# EAGLE design Datalogger_v1 (EAGLE 6.5.0)
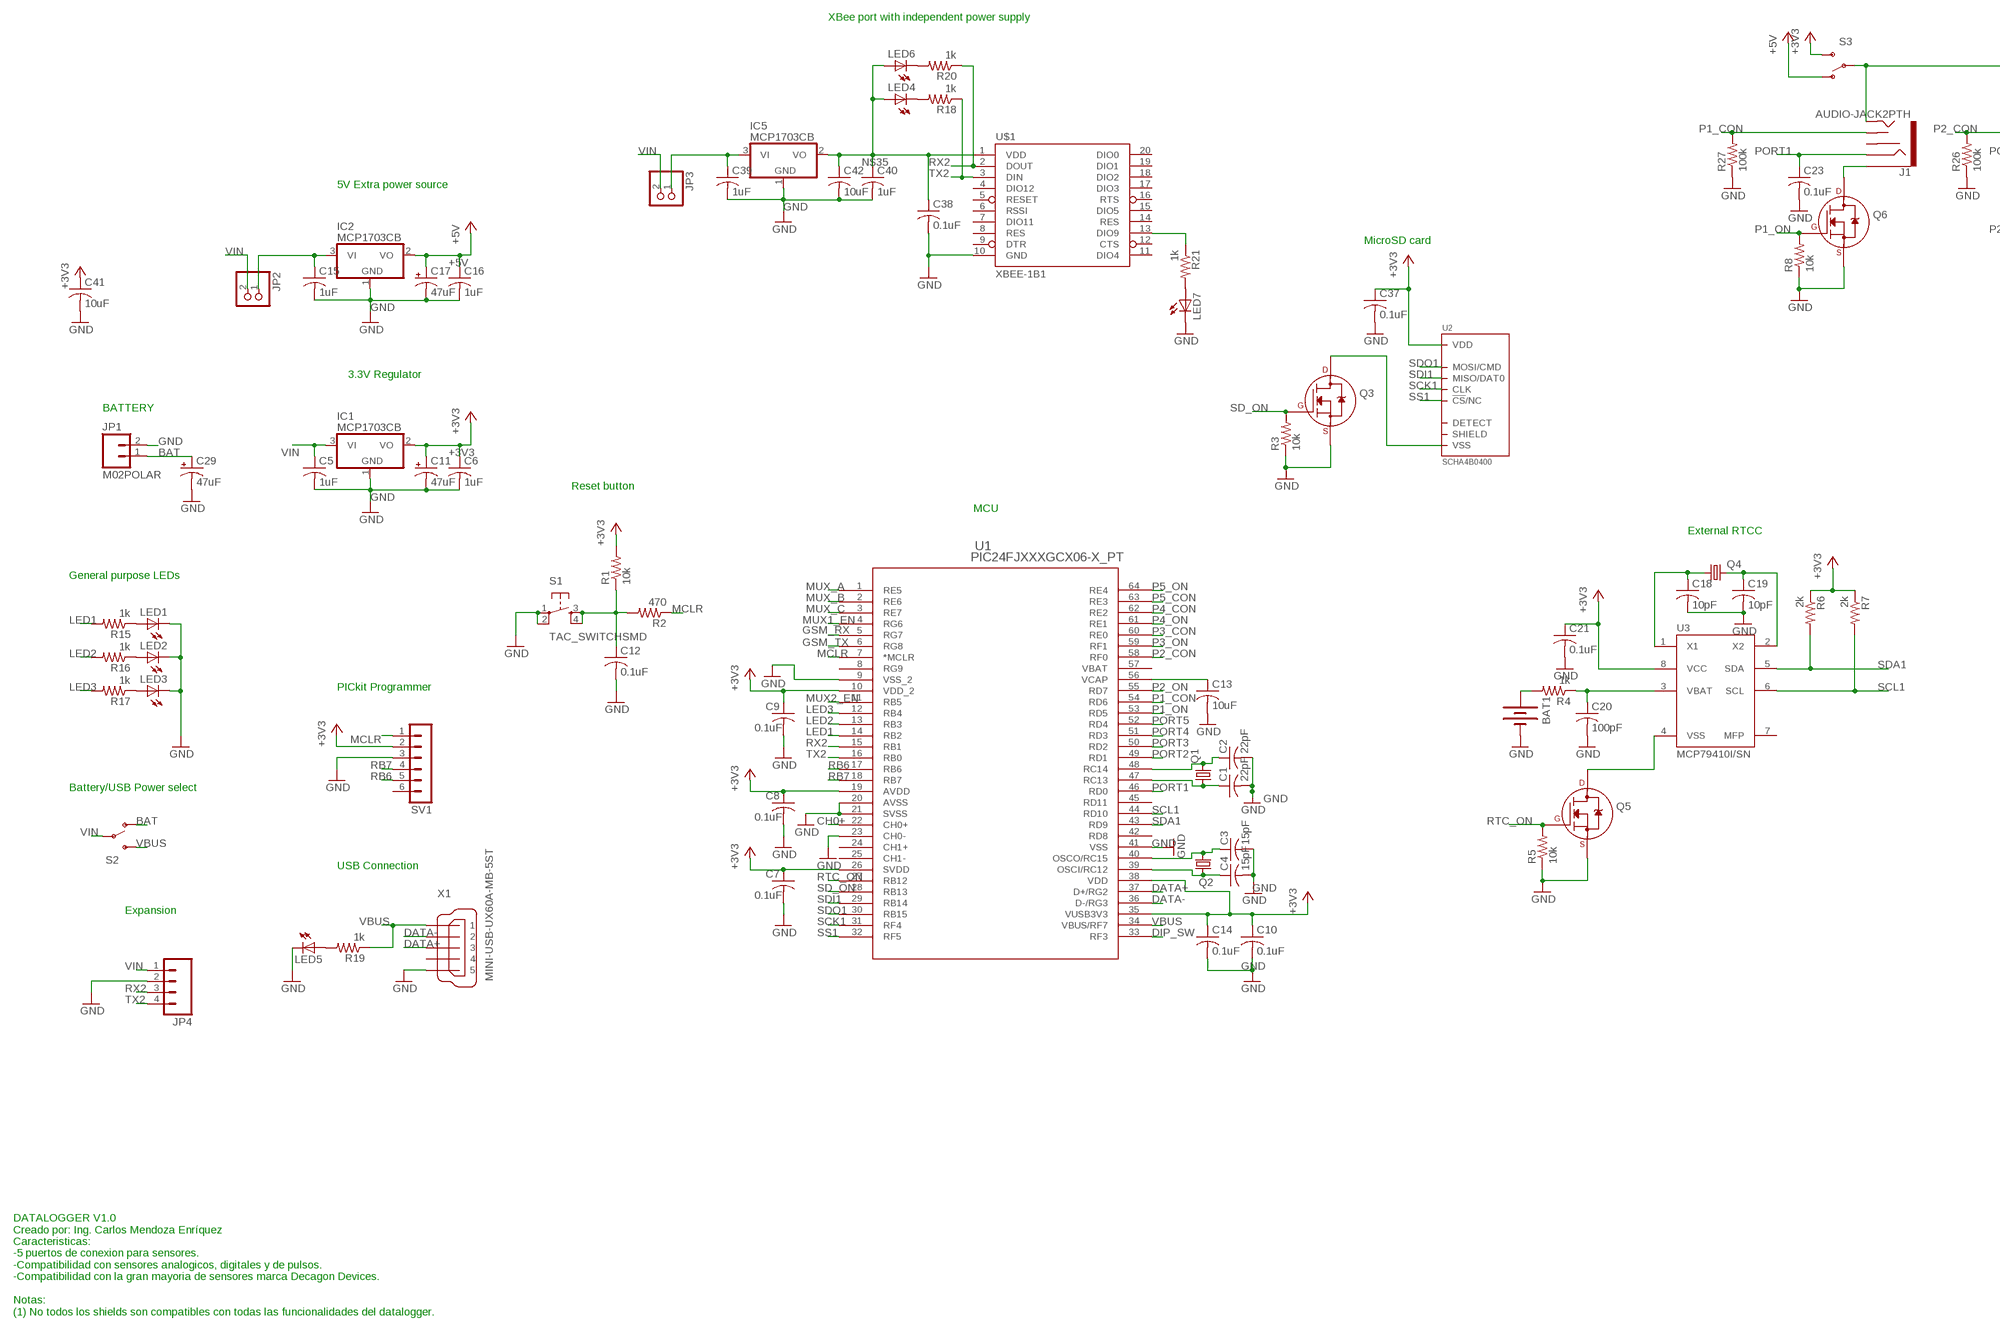
[diagram p0: schematic, sheet 1, part 1 of 2]
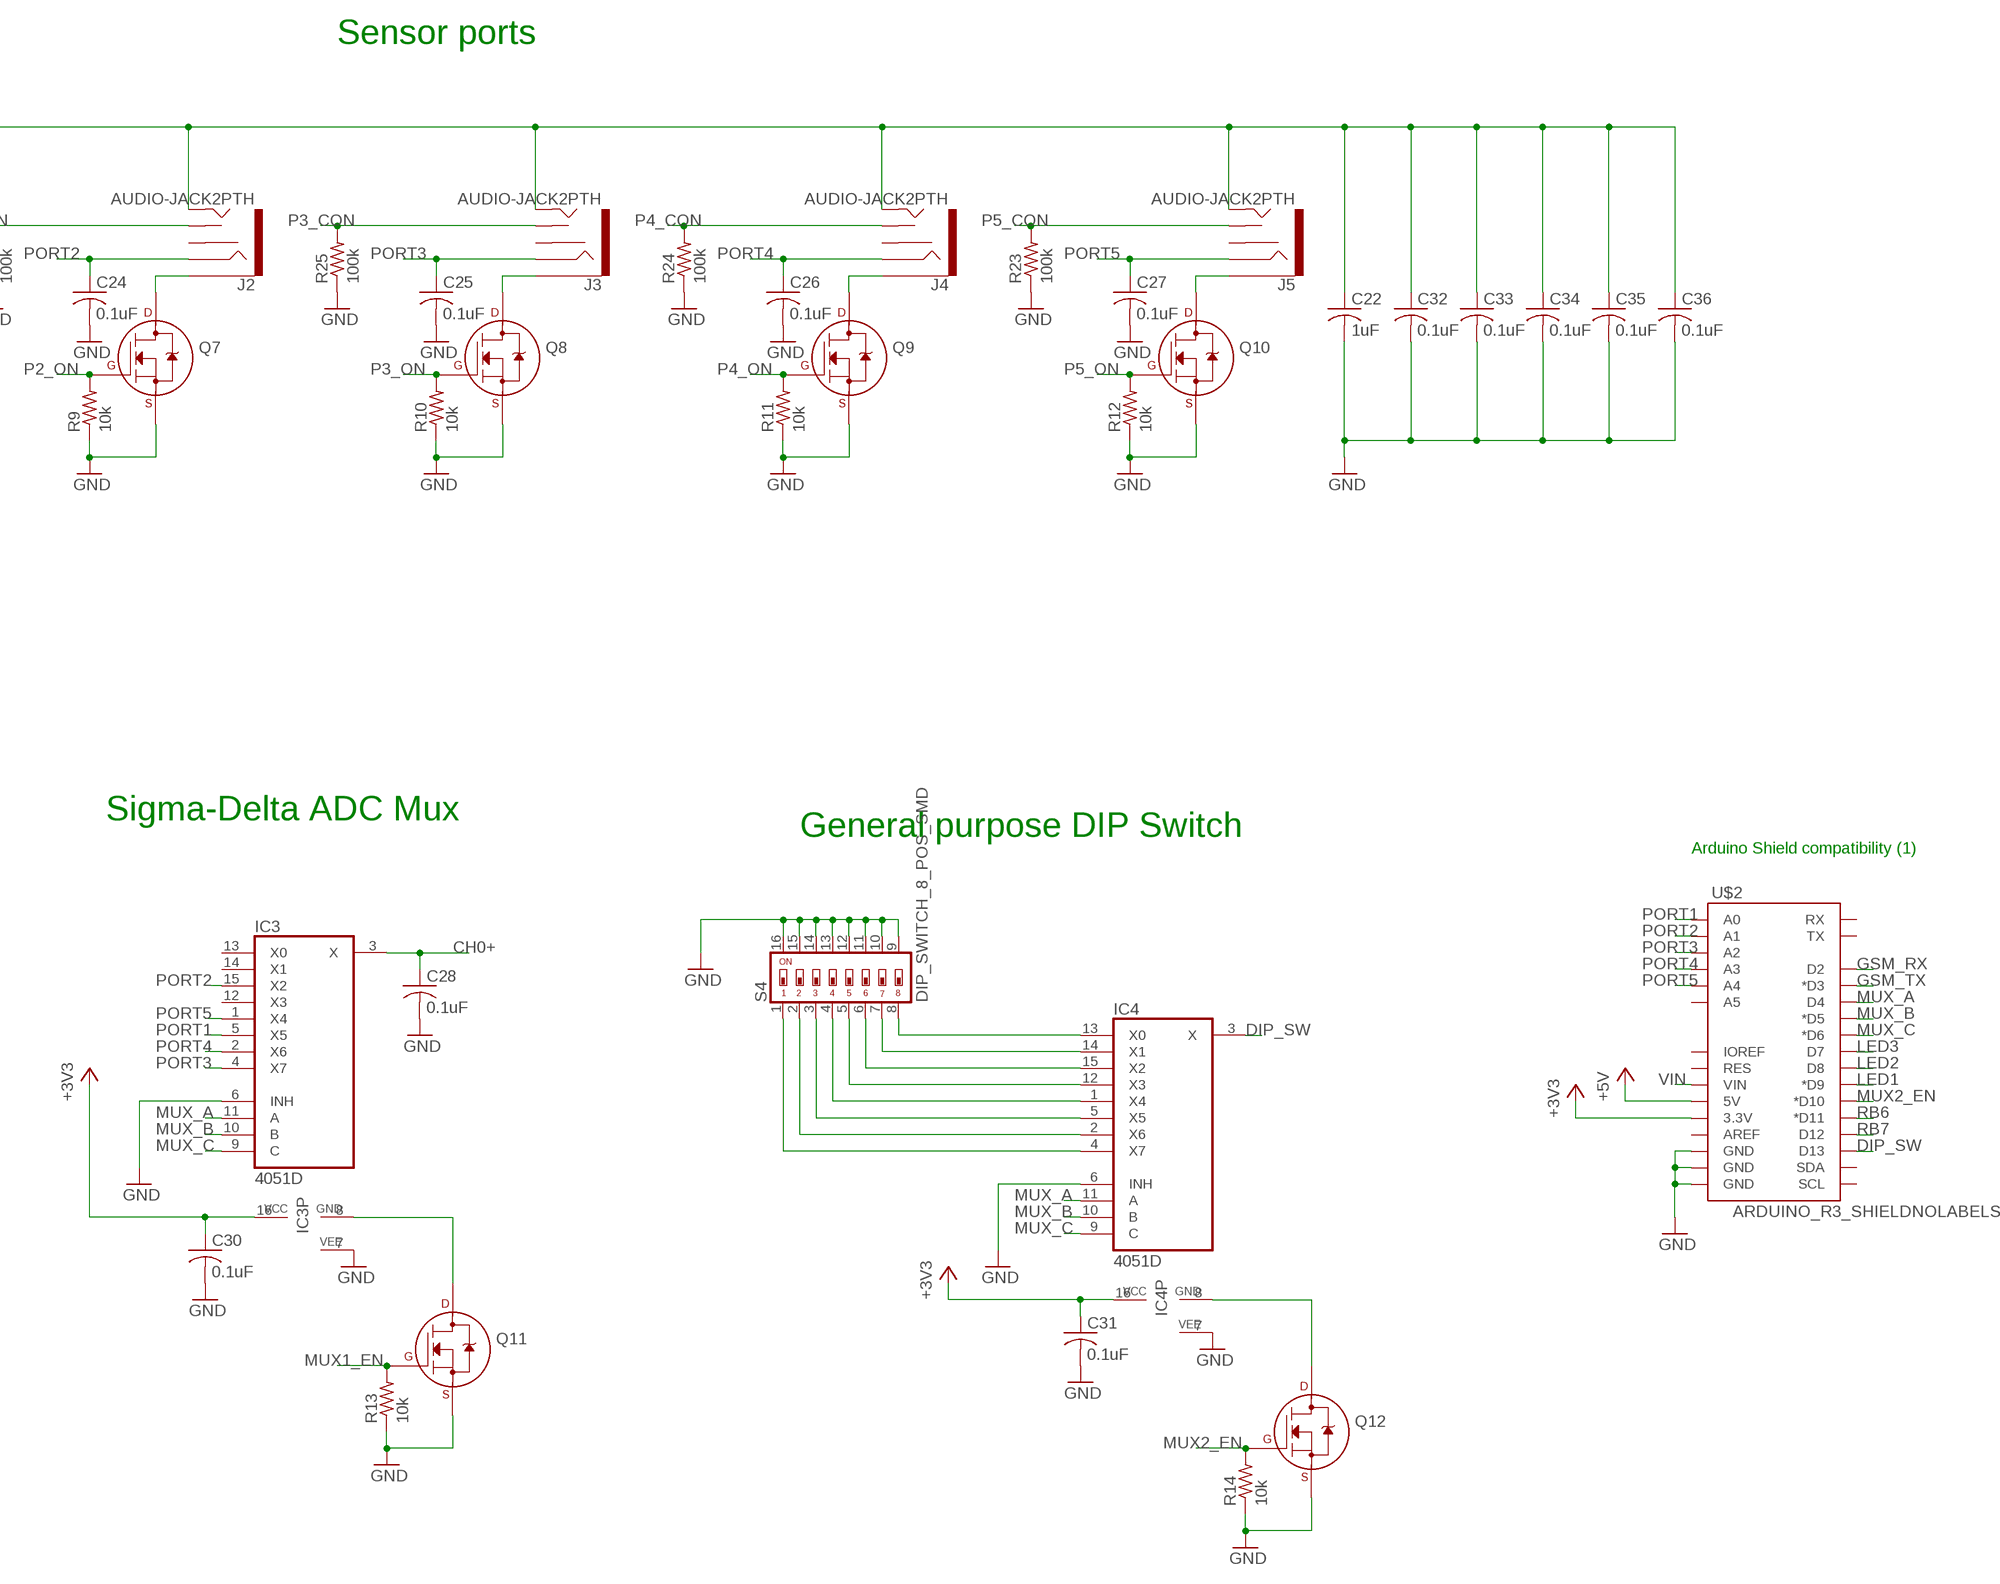
[diagram p1: schematic, sheet 1, part 2 of 2]

## Parts
BAT1  BATTERY20PTH  [BATTCOM_20MM_PTH]
C1  22pF  C-USC0603K  [C0603K]
C2  22pF  C-USC0603K  [C0603K]
C3  15pF  C-USC0603K  [C0603K]
C4  15pF  C-USC0603K  [C0603K]
C5  1uF  C-USC0805K  [C0805K]
C6  1uF  C-USC0805K  [C0805K]
C7  0.1uF  C-USC0805K  [C0805K]
C8  0.1uF  C-USC0805K  [C0805K]
C9  0.1uF  C-USC0805K  [C0805K]
C10  0.1uF  C-USC0805K  [C0805K]
C11  47uF  CPOL-US153CLV-0605  [153CLV-0605]
C12  0.1uF  C-USC0805K  [C0805K]
C13  10uF  C-USC0805K  [C0805K]
C14  0.1uF  C-USC0805K  [C0805K]
C15  1uF  C-USC0805K  [C0805K]
C16  1uF  C-USC0805K  [C0805K]
C17  47uF  CPOL-US153CLV-0605  [153CLV-0605]
C18  10pF  C-USC0603K  [C0603K]
C19  10pF  C-USC0603K  [C0603K]
C20  100pF  C-USC0805K  [C0805K]
C21  0.1uF  C-USC0805K  [C0805K]
C22  1uF  C-USC0805K  [C0805K]
C23  0.1uF  C-USC0805K  [C0805K]
C24  0.1uF  C-USC0805K  [C0805K]
C25  0.1uF  C-USC0805K  [C0805K]
C26  0.1uF  C-USC0805K  [C0805K]
C27  0.1uF  C-USC0805K  [C0805K]
C28  0.1uF  C-USC0805K  [C0805K]
C29  47uF  CPOL-US153CLV-0605  [153CLV-0605]
C30  0.1uF  C-USC0805K  [C0805K]
C31  0.1uF  C-USC0805K  [C0805K]
C32  0.1uF  C-USC0805K  [C0805K]
C33  0.1uF  C-USC0805K  [C0805K]
C34  0.1uF  C-USC0805K  [C0805K]
C35  0.1uF  C-USC0805K  [C0805K]
C36  0.1uF  C-USC0805K  [C0805K]
C37  0.1uF  C-USC0805K  [C0805K]
C38  0.1uF  C-USC0805K  [C0805K]
C39  1uF  C-USC0805K  [C0805K]
C40  1uF  C-USC0805K  [C0805K]
C41  10uF  C-USC0805K  [C0805K]
C42  10uF  C-USC0805K  [C0805K]
IC1  MCP1703CB  [SOT23]
IC2  MCP1703CB  [SOT23]
IC3  4051D  [SO16]
IC4  4051D  [SO16]
IC5  MCP1703CB  [SOT23]
J1  AUDIO-JACK2PTH  [AUDIO-JACK]
J2  AUDIO-JACK2PTH  [AUDIO-JACK]
J3  AUDIO-JACK2PTH  [AUDIO-JACK]
J4  AUDIO-JACK2PTH  [AUDIO-JACK]
J5  AUDIO-JACK2PTH  [AUDIO-JACK]
JP1  M02POLAR  [MOLEX-1X2]
JP2  PINHD-1X2  [1X02]
JP3  PINHD-1X2  [1X02]
JP4  M04POLAR  [MOLEX-1X4]
LED1  LEDCHIPLED_0603  [CHIPLED_0603]
LED2  LEDCHIPLED_0603  [CHIPLED_0603]
LED3  LEDCHIPLED_0603  [CHIPLED_0603]
LED4  LEDCHIPLED_0603  [CHIPLED_0603]
LED5  LEDCHIPLED_0603  [CHIPLED_0603]
LED6  LEDCHIPLED_0603  [CHIPLED_0603]
LED7  LEDCHIPLED_0603  [CHIPLED_0603]
Q1  CRYSTALMM20SS  [MM20SS]
Q2  CSM-7X-DU  [CSM-7X-DU]
Q3  2N7000_SOT23  [SOT-23]
Q4  CRYSTALMM20SS  [MM20SS]
Q5  2N7000_SOT23  [SOT-23]
Q6  2N7000_SOT23  [SOT-23]
Q7  2N7000_SOT23  [SOT-23]
Q8  2N7000_SOT23  [SOT-23]
Q9  2N7000_SOT23  [SOT-23]
Q10  2N7000_SOT23  [SOT-23]
Q11  2N7000_SOT23  [SOT-23]
Q12  2N7000_SOT23  [SOT-23]
R1  10k  R-US_R0805  [R0805]
R2  470  R-US_R0805  [R0805]
R3  10k  R-US_R0805  [R0805]
R4  1k  R-US_R0805  [R0805]
R5  10k  R-US_R0805  [R0805]
R6  2k  R-US_R0805  [R0805]
R7  2k  R-US_R0805  [R0805]
R8  10k  R-US_R0805  [R0805]
R9  10k  R-US_R0805  [R0805]
R10  10k  R-US_R0805  [R0805]
R11  10k  R-US_R0805  [R0805]
R12  10k  R-US_R0805  [R0805]
R13  10k  R-US_R0805  [R0805]
R14  10k  R-US_R0805  [R0805]
R15  1k  R-US_R0805  [R0805]
R16  1k  R-US_R0805  [R0805]
R17  1k  R-US_R0805  [R0805]
R18  1k  R-US_R0805  [R0805]
R19  1k  R-US_R0805  [R0805]
R20  1k  R-US_R0805  [R0805]
R21  1k  R-US_R0805  [R0805]
R23  100k  R-US_R0805  [R0805]
R24  100k  R-US_R0805  [R0805]
R25  100k  R-US_R0805  [R0805]
R26  100k  R-US_R0805  [R0805]
R27  100k  R-US_R0805  [R0805]
S1  TAC_SWITCHSMD  [TACTILE-SWITCH-SMD]
S2  SWITCH-SPDT-SMD-A  [SWITCH-SPST-SMD-A]
S3  SWITCH-SPDT-SMD-A  [SWITCH-SPST-SMD-A]
S4  DIP_SWITCH_8_POS_SMD  [SWITCH_04]
SV1  MA06-1  [MA06-1]
U1  PIC24FJXXXGCX06-X_PT  [TQFP64_10X10MC]
U2  SCHA4B0400  [SCHA4B0400]
U3  MCP79410I/SN  [SO8]
U$1  XBEE-1B1  [XBEE-1]
U$2  ARDUINO_R3_SHIELDNOLABELS  [UNO_R3_SHIELD_NOLABELS]
X1  MINI-USB-UX60A-MB-5ST  [UX60A-MB-5ST]

## Nets
+3V3: C6.1 C7.1 C8.1 C9.1 C10.1 C11.+ C14.1 C21.1 C30.1 C31.1 C37.1 C41.1 IC1.2(VO) IC3.16(VCC) IC4.16(VCC) R1.2 R6.1 R7.1 S3.3(S) SV1.2 U1.10(VDD_2) U1.19(AVDD) U1.26(SVDD) U1.35(VUSB3V3) U1.38(VDD) U2.VDD U3.8(VCC) U$2.3.3V
+5V: C16.1 C17.+ IC2.2(VO) S3.1(O) U$2.5V
AS_RESET: C12.1 R1.1 R2.2 S1.3 S1.4
BAT: C29.+ JP1.1 S2.1(O)
CH0+: C28.1 IC3.3(X) U1.22(CH0+)
DATA+: U1.37(D+/RG2) X1.3
DATA-: U1.36(D-/RG3) X1.2
DIP_SW: IC4.3(X) U1.33(RF3) U$2.D13
GND: BAT1.2(-) C1.2 C2.2 C3.2 C4.2 C5.2 C6.2 C7.2 C8.2 C9.2 C10.2 C11.- C12.2 C13.2 C14.2 C15.2 C16.2 C17.- C18.2 C19.2 C20.2 C21.2 C22.2 C23.2 C24.2 C25.2 C26.2 C27.2 C28.2 C29.- C30.2 C31.2 C32.2 C33.2 C34.2 C35.2 C36.2 C37.2 C38.2 C39.2 C40.2 C41.2 C42.2 IC1.1(GND) IC2.1(GND) IC3.6(INH) IC3.7(VEE) IC4.6(INH) IC4.7(VEE) IC5.1(GND) JP1.2 JP4.2 LED1.C LED2.C LED3.C LED5.C LED7.C Q3.2(S) Q5.2(S) Q6.2(S) Q7.2(S) Q8.2(S) Q9.2(S) Q10.2(S) Q11.2(S) Q12.2(S) R3.1 R5.1 R8.1 R9.1 R10.1 R11.1 R12.1 R13.1 R14.1 R23.1 R24.1 R25.1 R26.1 R27.1 S1.1 S1.2 S4.9 S4.10 S4.11 S4.12 S4.13 S4.14 S4.15 S4.16 SV1.3 U1.9(VSS_2) U1.20(AVSS) U1.21(SVSS) U1.23(CH0-) U1.41(VSS) U$1.10(GND) U$2.GND@0(GND) U$2.GND@1(GND) U$2.GND@2(GND) X1.5
GSM_RX: U1.5(RG7) U$2.D2
GSM_TX: U1.6(RG8) U$2.D3(*D3)
LED1: R15.2 U1.14(RB2) U$2.D9(*D9)
LED2: R16.2 U1.13(RB3) U$2.D8
LED3: R17.2 U1.12(RB4) U$2.D7
MCLR: R2.1 SV1.1 U1.7(*MCLR)
MUX1_EN: Q11.1(G) R13.2 U1.4(RG6)
MUX2_EN: Q12.1(G) R14.2 U1.11(RB5) U$2.D10(*D10)
MUX_A: IC3.11(A) IC4.11(A) U1.1(RE5) U$2.D4
MUX_B: IC3.10(B) IC4.10(B) U1.2(RE6) U$2.D5(*D5)
MUX_C: IC3.9(C) IC4.9(C) U1.3(RE7) U$2.D6(*D6)
N$1: C3.1 Q2.2 U1.40(OSCO/RC15)
N$2: C4.1 Q2.1 U1.39(OSCI/RC12)
N$3: C2.1 Q1.4 U1.48(RC14)
N$4: C1.1 Q1.1 U1.47(RC13)
N$5: C15.1 IC2.3(VI) JP2.1
N$6: LED1.A R15.1
N$7: BAT1.1(+) R4.2
N$8: C18.1 Q4.1 U3.1(X1)
N$9: C13.1 U1.56(VCAP)
N$10: Q3.3(D) U2.GND(VSS) U2.GND@1(VSS) U2.GND@2(VSS) U2.VSS
N$11: C39.1 IC5.3(VI) JP3.1
N$12: C19.1 Q4.4 U3.2(X2)
N$13: C20.1 R4.1 U3.3(VBAT)
N$14: Q5.3(D) U3.4(VSS)
N$15: J1.SLEEVE Q6.3(D)
N$16: IC4.8(GND) Q12.3(D)
N$18: J2.SLEEVE Q7.3(D)
N$19: C22.1 C32.1 C33.1 C34.1 C35.1 C36.1 J1.TIP J2.TIP J3.TIP J4.TIP J5.TIP S3.2(P)
N$20: IC3.8(GND) Q11.3(D)
N$21: J3.SLEEVE Q8.3(D)
N$22: IC4.4(X7) S4.1
N$23: J4.SLEEVE Q9.3(D)
N$24: IC4.2(X6) S4.2
N$25: J5.SLEEVE Q10.3(D)
N$26: IC4.5(X5) S4.3
N$27: IC4.1(X4) S4.4
N$28: IC4.12(X3) S4.5
N$29: IC4.15(X2) S4.6
N$30: IC4.14(X1) S4.7
N$31: IC4.13(X0) S4.8
N$32: LED2.A R16.1
N$33: LED3.A R17.1
N$34: LED5.A R19.2
N$35: C38.1 C40.1 C42.1 IC5.2(VO) LED4.A LED6.A U$1.1(VDD)
N$37: LED4.C R18.2
N$38: LED6.C R20.2
N$39: LED7.A R21.2
N$40: R21.1 U$1.13(DIO9)
P1_CON: J1.TSH R27.2 U1.54(RD6)
P1_ON: Q6.1(G) R8.2 U1.53(RD5)
P2_CON: J2.TSH R26.2 U1.58(RF0)
P2_ON: Q7.1(G) R9.2 U1.55(RD7)
P3_CON: J3.TSH R25.2 U1.60(RE0)
P3_ON: Q8.1(G) R10.2 U1.59(RF1)
P4_CON: J4.TSH R24.2 U1.62(RE2)
P4_ON: Q9.1(G) R11.2 U1.61(RE1)
P5_CON: J5.TSH R23.2 U1.63(RE3)
P5_ON: Q10.1(G) R12.2 U1.64(RE4)
PORT1: C23.1 IC3.5(X5) J1.RING U1.46(RD0) U$2.A0
PORT2: C24.1 IC3.15(X2) J2.RING U1.49(RD1) U$2.A1
PORT3: C25.1 IC3.4(X7) J3.RING U1.50(RD2) U$2.A2
PORT4: C26.1 IC3.2(X6) J4.RING U1.51(RD3) U$2.A3
PORT5: C27.1 IC3.1(X4) J5.RING U1.52(RD4) U$2.A4
RB6: SV1.5 U1.17(RB6) U$2.D11(*D11)
RB7: SV1.4 U1.18(RB7) U$2.D12
RTC_ON: Q5.1(G) R5.2 U1.27(RB12)
RX2: JP4.3 R20.1 U1.15(RB1) U$1.2(DOUT)
SCK1: U1.31(RF4) U2.CLK
SCL1: R7.2 U1.44(RD10) U3.6(SCL)
SD_ON: Q3.1(G) R3.2 U1.28(RB13)
SDA1: R6.2 U1.43(RD9) U3.5(SDA)
SDI1: U1.29(RB14) U2.MISO/DAT0
SDO1: U1.30(RB15) U2.MOSI/CMD
SS1: U1.32(RF5) U2.!CS!/NC/DAT3(!CS!/NC)
TX2: JP4.4 R18.1 U1.16(RB0) U$1.3(DIN)
VBUS: R19.1 S2.3(S) U1.34(VBUS/RF7) X1.1
VIN: C5.1 IC1.3(VI) JP2.2 JP3.2 JP4.1 S2.2(P) U$2.VIN
Unconnected: IC3.12(X3) IC3.13(X0) IC3.14(X1) J1.RSH J2.RSH J3.RSH J4.RSH J5.RSH SV1.6 U1.8(RG9) U1.24(CH1+) U1.25(CH1-) U1.42(RD8) U1.45(RD11) U2.CD(DETECT) U2.SHIELD U2.SHIELD@1(SHIELD) U2.SHIELD@2(SHIELD) U2.SHIELD@3(SHIELD) U3.7(MFP) U$1.4(DIO12) U$1.5(RESET) U$1.6(RSSI) U$1.7(DIO11) U$1.8(RES) U$1.9(DTR) U$1.11(DIO4) U$1.12(CTS) U$1.14(RES) U$1.15(DIO5) U$1.16(RTS) U$1.17(DIO3) U$1.18(DIO2) U$1.19(DIO1) U$1.20(DIO0) U$2.A5 U$2.AREF U$2.IOREF U$2.RES U$2.RX U$2.SCL U$2.SDA U$2.TX X1.4

## Notes on the sheet
- Sensor ports
- XBee port with independent power supply
- 5V Extra power source
- MicroSD card
- 3.3V Regulator
- BATTERY
- Reset button
- MCU
- External RTCC | Sigma-Delta ADC Mux
- General purpose DIP Switch
- Arduino Shield compatibility (1)
- General purpose LEDs
- PICkit Programmer
- Battery/USB Power select
- USB Connection
- Expansion
- DATALOGGER V1.0
  Creado por: Ing. Carlos Mendoza Enríquez
  Caracteristicas:
  -5 puertos de conexion para sensores.
  -Compatibilidad con sensores analogicos, digitales y de pulsos.
  -Compatibilidad con la gran mayoria de sensores marca Decagon Devices.
  
  Notas:
  (1) No todos los shields son compatibles con todas las funcionalidades del datalogger.

## Power pins joined to a net without a drawn wire
VBAT: U1.57(VBAT)

## Library data of the parts
BAT1 = SparkFun-Electromechanical:BATTERY: Battery Holders Various common sizes : AA, AAA, 20mm coin cell and 12mm coin cell. 20MM_4LEGS, BATT-10373
C1-C10 C12-C16 C18-C28 C30-C42 = resistor:C-US: CAPACITOR, American symbol
C11 C17 C29 = resistor:CPOL-US: POLARIZED CAPACITOR, American symbol
IC1 IC2 IC5 = linear:MCP1703: 250 mA, 16V, Low Quiescent Current LDO Regulator Source: http://ww1.microchip.com/downloads/en/DeviceDoc/22049b.pdf
IC3 IC4 = 40xx:4051: 8-channel ANALOG MULTIPLEXER
J1-J5 = SparkFun-Connectors:AUDIO-JACK2: Stereo audio jack with bypass switches. SMT version used on LilyPad MP3 board.; PROD_ID: CONN-08774
JP1 = SparkFun-Connectors:M02: Standard 2-pin 0.1" header. Use with - straight break away headers ( PRT-00116) - right angle break away headers (PRT-00553) - swiss pins (PRT-00743) - machine pins (PRT-00117) - female headers (PRT-00115) Molex polarized connector foot print use with: PRT-08233 with associated crimp pins and housings. 2.54_SCREWTERM for use with PRT-10571. 3.5mm Screw Terminal footprints for PRT-08084 5mm Screw Terminal footprints for use with PRT-08432
JP2 JP3 = pinhead:PINHD-1X2: PIN HEADER
JP4 = SparkFun-Connectors:M04: Header 4 Standard 4-pin 0.1" header. Use with straight break away headers (SKU : PRT-00116), right angle break away headers (PRT-00553), swiss pins (PRT-00743), machine pins (PRT-00117), and female headers (PRT-00115). Molex polarized connector foot print use with SKU : PRT-08231 with associated crimp pins and housings. 1MM SMD Version SKU: PRT-10208
LED1-LED7 = led:LED: LED OSRAM: - CHIPLED LG R971, LG N971, LY N971, LG Q971, LY Q971, LO R971, LY R971 LH N974, LH R974 LS Q976, LO Q976, LY Q976 LO Q996 - Hyper CHIPLED LW Q18S LB Q993, LB Q99A, LB R99A - SideLED LS A670, LO A670, LY A670, LG A670, LP A670 LB A673, LV A673, LT A673, LW A673 LH A674 LY A675 LS A676, LA A676, LO A676, LY A676, LW A676 LS A679, LY A679, LG A679 - Hyper Micro SIDELED® LS Y876, LA Y876, LO Y876, LY Y876 LT Y87S - SmartLED LW L88C, LW L88S LB L89C, LB L89S, LG L890 LS L89K, LO L89K, LY L89K LS L896, LA L896, LO L896, LY L896 - TOPLED LS T670, LO T670, LY T670, LG T670, LP T670 LSG T670, LSP T670, LSY T670, LOP T670, LYG T670 LG T671, LOG T671, LSG T671 LB T673, LV T673, LT T673, LW T673 LH T674 LS T676, LA T676, LO T676, LY T676, LB T676, LH T676, LSB T676, LW T676 LB T67C, LV T67C, LT T67C, LS T67K, LO T67K, LY T67K, LW E67C LS E67B, LA E67B, LO E67B, LY E67B, LB E67C, LV E67C, LT E67C LW T67C LS T679, LY T679, LG T679 LS T770, LO T770, LY T770, LG T770, LP T770 LB T773, LV T773, LT T773, LW T773 LH T774 LS E675, LA E675, LY E675, LS T675 LS T776, LA T776, LO T776, LY T776, LB T776 LHGB T686 LT T68C, LB T68C - Hyper Mini TOPLED® LB M676 - Mini TOPLED Santana® LG M470 LS M47K, LO M47K, LY M47K Source: http://www.osram.convergy.de LUXEON: - LUMILED® LXK2-PW12-R00, LXK2-PW12-S00, LXK2-PW14-U00, LXK2-PW14-V00 LXK2-PM12-R00, LXK2-PM12-S00, LXK2-PM14-U00 LXK2-PE12-Q00, LXK2-PE12-R00, LXK2-PE12-S00, LXK2-PE14-T00, LXK2-PE14-U00 LXK2-PB12-K00, LXK2-PB12-L00, LXK2-PB12-M00, LXK2-PB14-N00, LXK2-PB14-P00, LXK2-PB14-Q00 LXK2-PR12-L00, LXK2-PR12-M00, LXK2-PR14-Q00, LXK2-PR14-R00 LXK2-PD12-Q00, LXK2-PD12-R00, LXK2-PD12-S00 LXK2-PH12-R00, LXK2-PH12-S00 LXK2-PL12-P00, LXK2-PL12-Q00, LXK2-PL12-R00 Source: www.luxeon.com KINGBRIGHT: KA-3528ASYC Source: www.kingbright.com
Q1 Q4 = crystal:CRYSTAL: CRYSTAL; OC_FARNELL: unknown; OC_NEWARK: unknown
Q2 = crystal:CSM-7X-DU: SMD CRYSTAL Source: www.ecsxtal.com .. Crystal 3.6864MHz CSM_7X_DU.PDF; OC_FARNELL: unknown; OC_NEWARK: unknown
Q3 Q5-Q12 = transistors:2N700*: 2N7000, 2N7002, NDS7002A N-channel enhancement mode MOSFET
R1-R21 R23-R27 = resistor:R-US_: RESISTOR, American symbol
S1 = SparkFun-Electromechanical:TAC_SWITCH: Momentary Switch Button commonly used for reset or general input. Spark Fun Electronics SKU : COM-00097 SMT- SWCH-08247; PROD_ID: SWCH-08247
S2 S3 = SparkFun-Electromechanical:SWITCH-SPDT: SPDT Switch Simple slide switch, Spark Fun Electronics SKU : COM-00102 DPDT SMT slide switch, AYZ0202, SWCH-08179
S4 = smd-special:DIP_SWITCH_8_POS_SMD: SMD Dip Switch 8 pol.
SV1 = con-lstb:MA06-1: PIN HEADER; OC_FARNELL: unknown; OC_NEWARK: unknown
U1 = PIC24FJ128GC006_PT:PIC24FJXXXGCX06-X_PT; MANUFACTURER_PART_NUMBER: pic24fjxxxgcx06-x_pt; VENDOR: MICROCHIP
U2 = alps:SCHA4B0400
U3 = _hhn_MCP7941X:MCP7941*?: Microchip MCP79410 / MCP79411 / MCP79412 I²C Real Time CLock/Calendar with Unique ID Rev. 5.0.0 as of 2013-10-23, for EAGLE 5+ Changelog 5.0.0 (initial) MCP79410XI/YY X: Unique ID 0: blank 1: EUI-48 2: EUI-96 I: Temperature Range (Industrial) /YY: Package /MS: MSOP8_.65 (8-Lead Micro Small Outline Package, 0.65mm pitch) /SN: SOIC8 (8-Lead Small Outline [Narrow], 3.9mm body) /ST: TSSOP8 (8-Lead Thin Schrink Small Outline, 4.4mm body) Source: http://www.microchip.com Author: Dipl.-Ing. FH Rainer Bayer Heilbronn University HHN http://www.hs-heilbronn.de/rainer.bayer · rainer.bayer@hs-heilbronn.de Engineering office ing-rb: http://www.ing-rb.de/ · eagle@ing-rb.de Lectureship dozent-rb: http://www.dozent-rb.de/ · eagle@dozent-rb.de
U$1 = SparkFun-RF:XBEE-1: Xbee module footprints SMT header is CONN-09042.
U$2 = SparkFun-Boards:ARDUINO_R3_SHIELD: Shield form compatible with the Arduino Uno R3.
X1 = con-hirose:MINI-USB-: MINI USB Connector Source: http://www.hirose.co.jp/cataloge_hp/e24000019.pdf; OC_FARNELL: unknown; OC_NEWARK: unknown

## Board
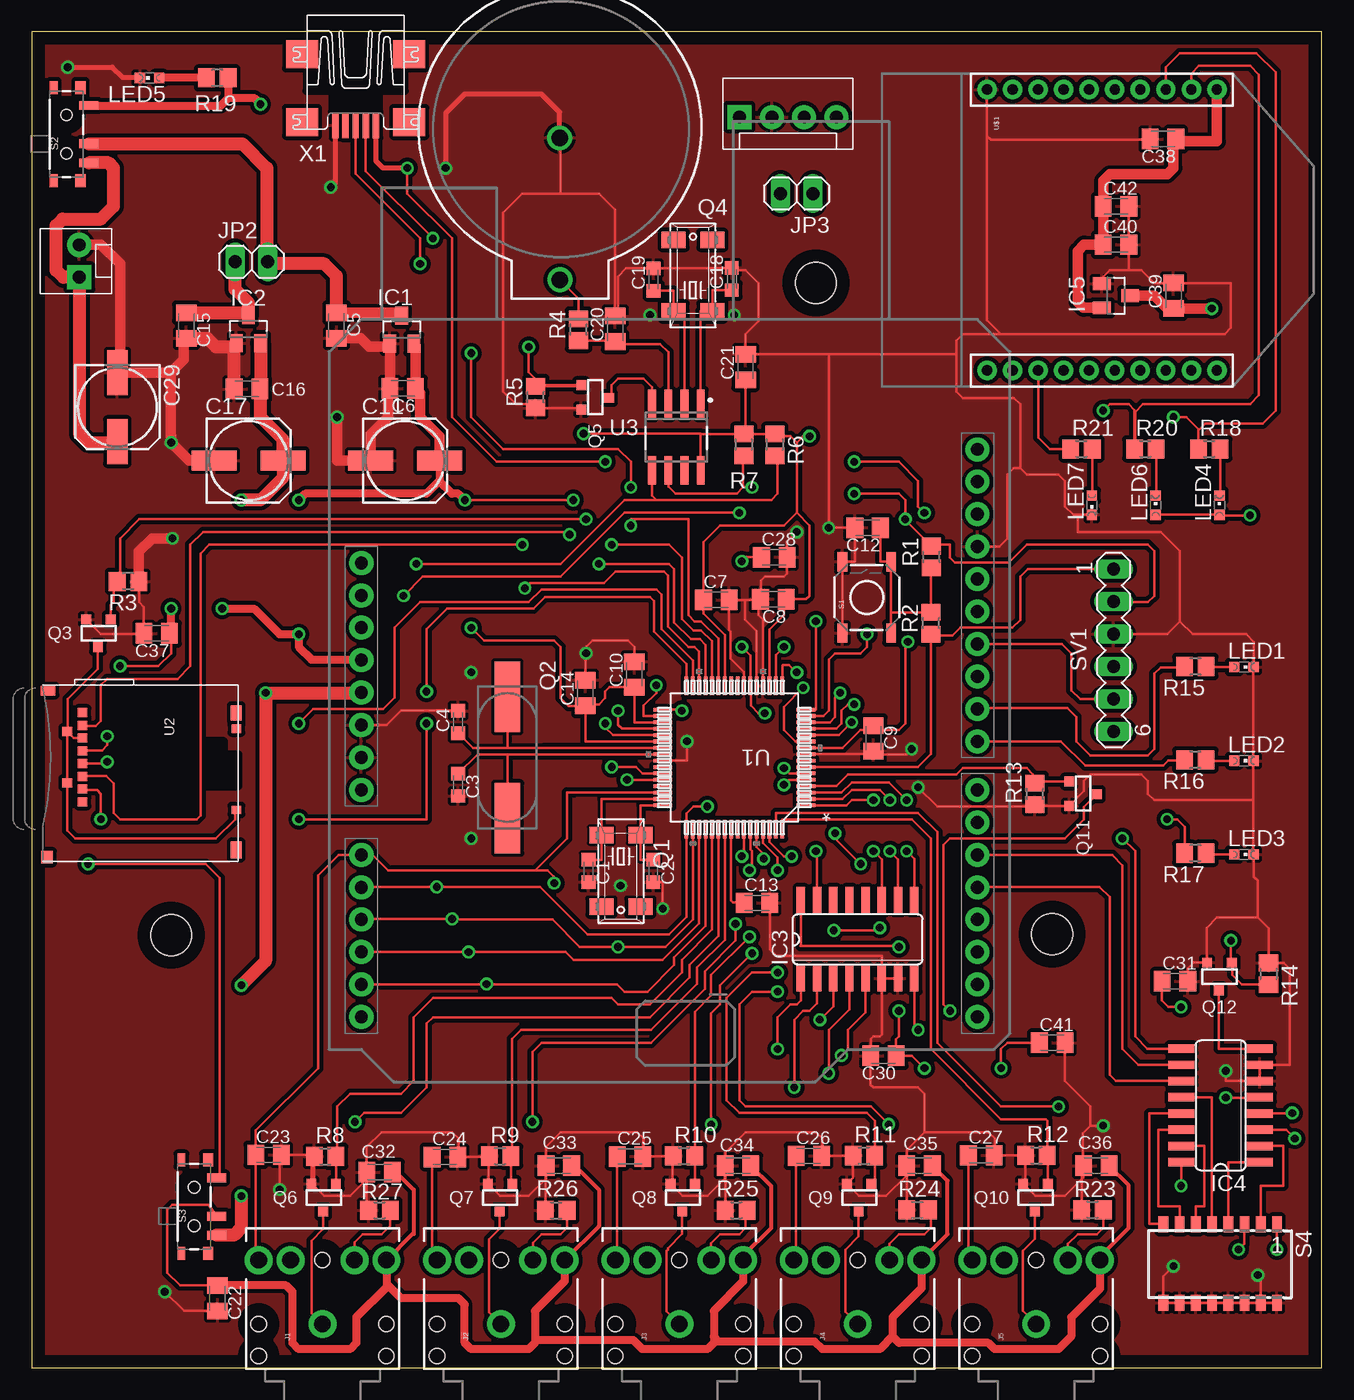
[diagram p2: board, top side]
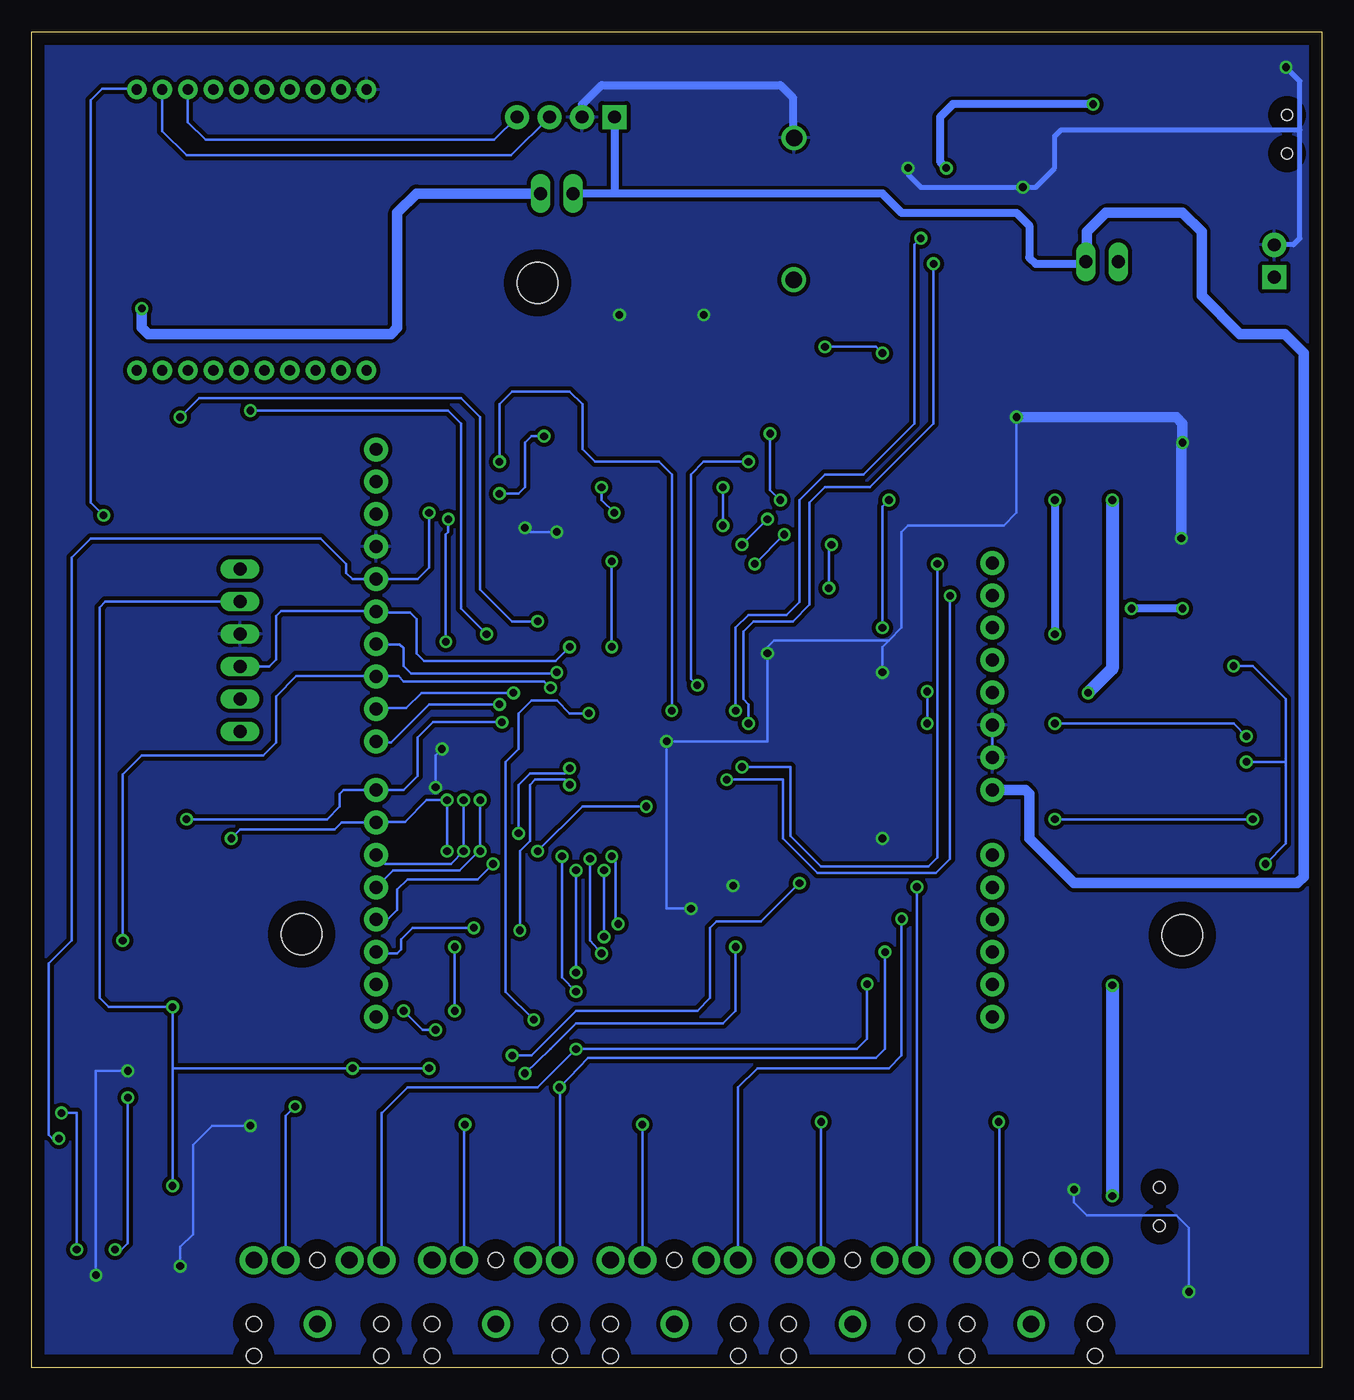
[diagram p3: board, bottom side, seen from below]

Size 101.01 x 104.6 mm. Coordinates in mm from the lower left corner, seen from the top.
Outline: 0,0 101.01,0 101.01,104.6 0,104.6 0,0
Copper layers (1*16): Top 0.035mm / dielectric 1.5mm / Bottom 0.035mm
Design rules "default *": minimum track width 8mil, minimum drill 8mil, track to track 8mil, track to pad 8mil, pad to pad 8mil, via to via 8mil, smd to smd 8mil, copper to edge 40mil, drill to drill 8mil, minimum pad ring 10mil, minimum via ring 8mil, stop-mask expansion 4mil, vias tented up to drill 0mil, thermal gap 10mil
Holes 3.2 mm at 61.4,84.94 79.9,33.94 10.91,33.86

### Footprints (pad centres in the part's own frame; a part is rotated, then mirrored left to right if it is on the bottom)
BATTCOM_20MM_PTH = drill 1.3: 1 11.85,0; 2 0.74,-0.025
C0603K = smd 1.05 x 1.08: 1 -0.875,0; 2 0.875,0
C0805K = smd 1.3 x 1.6: 1 -1,0; 2 1,0
153CLV-0605 = smd 3.5 x 1.6: + 2.7,0; - -2.7,0
SOT23 = smd 1 x 1.4: 1 -0.95,-1.1; 2 0.95,-1.1; 3 0,1.1
SO16 = smd 0.66 x 2.032: 1 -4.445,-3.073; 2 -3.175,-3.073; 3 -1.905,-3.073; 4 -0.635,-3.073; 5 0.635,-3.073; 6 1.905,-3.073; 7 3.175,-3.073; 8 4.445,-3.073; 9 4.445,3.073; 10 3.175,3.073; 11 1.905,3.073; 12 0.635,3.073; 13 -0.635,3.073; 14 -1.905,3.073; 15 -3.175,3.073; 16 -4.445,3.073
AUDIO-JACK = drill 1.3 pad 2.184: RING 5,5; RSH 5,2.5; SLEEVE 0,0; TIP 5,-5; TSH 5,-2.5 | hole 1.2: 0,5; -2.5,5; -2.5,-5; 0,-5; 5,0
MOLEX-1X2 = drill 1.016 pad 1.88 square: 1 0,0 | drill 1.016 pad 1.88: 2 2.54,0
1X02 = drill 1.016 long: 1 -1.27,0; 2 1.27,0
MOLEX-1X4 = drill 1.016 pad 1.88 square: 1 0,0 | drill 1.016 pad 1.88: 2 2.54,0; 3 5.08,0; 4 7.62,0
CHIPLED_0603 = smd 0.8 x 0.8: A 0,-0.75; C 0,0.75
MM20SS = smd 1.27 x 1.88: 1 -2.794,-1.524; 2 2.794,-1.524; 3 2.794,1.524; 4 -2.794,1.524
CSM-7X-DU = smd 5.5 x 2: 1 -4.75,0; 2 4.75,0
SOT-23 = smd 0.762 x 0.762: 1 -0.979,-1.101; 2 0.94,-1.101; 3 0.025,1.067
R0805 = smd 1.3 x 1.5: 1 -0.85,0; 2 0.85,0
TACTILE-SWITCH-SMD = smd 1.524 x 0.762: 1 -2.794,1.905; 2 2.794,1.905; 3 -2.794,-1.905; 4 2.794,-1.905
SWITCH-SPST-SMD-A = smd 0.7 x 1.5: 1 -2.25,-1.75; 2 -0.75,-1.75; 3 2.25,-1.75 | smd 1 x 0.6: GND1 -3.65,1; GND3 3.65,1 | smd 1 x 0.8: GND2 -3.65,-1.1; GND4 3.65,-1.1 | hole 0.9: -1.5,0; 1.5,0
SWITCH_04 = smd 0.76 x 1.25: 1 -1.9,-3.12; 2 -0.63,-3.12; 3 0.64,-3.12; 4 1.91,-3.12; 5 3.18,-3.12; 6 4.45,-3.12; 7 5.72,-3.12; 8 6.99,-3.12; 9 6.99,3.04; 10 5.72,3.04; 11 4.45,3.04; 12 3.18,3.04; 13 1.91,3.04; 14 0.64,3.04; 15 -0.63,3.04; 16 -1.9,3.04
MA06-1 = drill 1.016 long: 1 -6.35,0; 2 -3.81,0; 3 -1.27,0; 4 1.27,0; 5 3.81,0; 6 6.35,0
TQFP64_10X10MC = smd 1.473 x 0.279: 1 -5.613,3.75; 2 -5.613,3.25; 3 -5.613,2.75; 4 -5.613,2.25; 5 -5.613,1.75; 6 -5.613,1.25; 7 -5.613,0.75; 8 -5.613,0.25; 9 -5.613,-0.25; 10 -5.613,-0.75; 11 -5.613,-1.25; 12 -5.613,-1.75; 13 -5.613,-2.25; 14 -5.613,-2.75; 15 -5.613,-3.25; 16 -5.613,-3.75; 33 5.613,-3.75; 34 5.613,-3.25; 35 5.613,-2.75; 36 5.613,-2.25; 37 5.613,-1.75; 38 5.613,-1.25; 39 5.613,-0.75; 40 5.613,-0.25; 41 5.613,0.25; 42 5.613,0.75; 43 5.613,1.25; 44 5.613,1.75; 45 5.613,2.25; 46 5.613,2.75; 47 5.613,3.25; 48 5.613,3.75 | smd 0.279 x 1.473: 17 -3.75,-5.613; 18 -3.25,-5.613; 19 -2.75,-5.613; 20 -2.25,-5.613; 21 -1.75,-5.613; 22 -1.25,-5.613; 23 -0.75,-5.613; 24 -0.25,-5.613; 25 0.25,-5.613; 26 0.75,-5.613; 27 1.25,-5.613; 28 1.75,-5.613; 29 2.25,-5.613; 30 2.75,-5.613; 31 3.25,-5.613; 32 3.75,-5.613; 49 3.75,5.613; 50 3.25,5.613; 51 2.75,5.613; 52 2.25,5.613; 53 1.75,5.613; 54 1.25,5.613; 55 0.75,5.613; 56 0.25,5.613; 57 -0.25,5.613; 58 -0.75,5.613; 59 -1.25,5.613; 60 -1.75,5.613; 61 -2.25,5.613; 62 -2.75,5.613; 63 -3.25,5.613; 64 -3.75,5.613
SCHA4B0400 = smd 0.7 x 0.75: !CS!/NC/DAT3 8.162,3.125; CLK 5.162,3.125; GND 3.663,1.925; GND@1 7.662,1.925; MISO/DAT0 3.163,3.125; MOSI/CMD 7.162,3.125; NC/NC/DAT1 2.163,3.125; NC/NC/DAT2 9.162,3.125; VDD 6.162,3.125; VSS 4.162,3.125 | smd 0.65 x 0.75: CD 3.438,15.175; GND@2 9.787,15.175 | smd 0.745 x 1.15: SHIELD 0.453,0.425 | smd 0.95 x 0.9: SHIELD@1 13.488,0.35 | smd 1.3 x 0.85: SHIELD@2 12.925,15.15 | smd 1.2 x 0.85: SHIELD@3 2.2,15.15
SO8 = smd 0.6 x 2.2: 1 -1.905,-2.6; 2 -0.635,-2.6; 3 0.635,-2.6; 4 1.905,-2.6; 5 1.905,2.6; 6 0.635,2.6; 7 -0.635,2.6; 8 -1.905,2.6
XBEE-1 = drill 0.8 pad 1.524: 1 -11,20; 2 -11,18; 3 -11,16; 4 -11,14; 5 -11,12; 6 -11,10; 7 -11,8; 8 -11,6; 9 -11,4; 10 -11,2; 11 11,2; 12 11,4; 13 11,6; 14 11,8; 15 11,10; 16 11,12; 17 11,14; 18 11,16; 19 11,18; 20 11,20
UNO_R3_SHIELD_NOLABELS = drill 1.016 pad 1.88: 3.3V 50.8,26.67; 5V 50.8,29.21; A0 50.8,41.91; A1 50.8,44.45; A2 50.8,46.99; A3 50.8,49.53; A4 50.8,52.07; A5 50.8,54.61; AREF 2.54,15.24; D2 2.54,49.53; D3 2.54,46.99; D4 2.54,44.45; D5 2.54,41.91; D6 2.54,39.37; D7 2.54,36.83; D8 2.54,33.02; D9 2.54,30.48; D10 2.54,27.94; D11 2.54,25.4; D12 2.54,22.86; D13 2.54,20.32; GND@0 50.8,31.75; GND@1 50.8,34.29; GND@2 2.54,17.78; IOREF 50.8,21.59; NC 50.8,19.05; RES 50.8,24.13; RX 2.54,54.61; SCL 2.54,10.16; SDA 2.54,12.7; TX 2.54,52.07; VIN 50.8,36.83
UX60A-MB-5ST = smd 2 x 0.5: 1 2.25,1.6; 2 2.25,0.8; 3 2.25,0; 4 2.25,-0.8; 5 2.25,-1.6 | smd 2.2 x 2.5: M1 -3.3,-4.2; M2 -3.3,4.2; M3 2,4.2; M4 2,-4.2

### Placement (x,y rotation side)
BAT1  41.35,97.04 270 top
C1  43.58,38.89 270 top
C2  48.66,38.89 270 top
C3  33.38,45.64 270 top
C4  33.38,50.56 90 top
C5  23.85,81.61 270 top
C6  29.04,76.68 180 top
C7  53.59,60.12 0 top
C8  58.06,60.17 180 top
C9  65.9,49.28 270 top
C10  47.18,54.29 90 top
C11  29.23,71.03 0 top
C12  65.45,65.77 180 top
C13  56.78,36.39 0 top
C14  43.34,52.83 90 top
C15  12.09,81.61 270 top
C16  16.84,76.64 180 top
C17  16.97,71.03 0 top
C18  54.81,85.25 90 top
C19  48.69,85.21 90 top
C20  45.68,81.35 90 top
C21  55.88,78.36 90 top
C22  14.53,5.43 270 top
C23  18.54,16.66 0 top
C24  32.34,16.5 0 top
C25  46.84,16.54 0 top
C26  60.84,16.58 0 top
C27  74.34,16.62 0 top
C28  58.14,63.46 0 top
C29  6.69,75.22 270 top
C30  66.68,24.42 180 top
C31  89.52,30.26 0 top
C32  27.23,15.31 180 top
C33  41.26,15.81 180 top
C34  55.29,15.81 180 top
C35  69.52,15.81 180 top
C36  83.35,15.81 180 top
C37  9.77,57.5 180 top
C38  88.58,96.21 180 top
C39  89.4,83.94 90 top
C40  84.9,87.94 0 top
C41  79.9,25.44 0 top
C42  84.9,90.94 0 top
IC1  28.96,81.28 0 top
IC2  16.96,81.32 0 top
IC3  64.66,33.54 0 top
IC4  93.1,20.53 90 top
IC5  84.9,83.94 270 top
J1  22.76,3.41 90 top
J2  36.73,3.41 90 top
J3  50.7,3.41 90 top
J4  64.67,3.41 90 top
J5  78.64,3.41 90 top
JP1  3.71,85.38 90 top
JP2  17.19,86.6 0 top
JP3  59.9,91.94 180 top
JP4  55.4,97.94 0 top
LED1  94.92,54.86 270 top
LED2  94.92,47.52 270 top
LED3  94.92,40.18 270 top
LED4  93,67.54 0 top
LED5  9.21,101 90 top
LED6  88,67.54 0 top
LED7  83,67.54 180 top
Q1  46.12,38.89 270 top
Q2  37.23,47.78 270 top
Q3  5.19,57.5 180 top
Q4  51.77,85.52 90 top
Q5  44.12,75.97 270 top
Q6  22.83,13.29 180 top
Q7  36.64,13.29 180 top
Q8  50.95,13.29 180 top
Q9  64.77,13.29 180 top
Q10  78.58,13.29 180 top
Q11  82.33,44.92 270 top
Q12  92.98,30.61 180 top
R1  70.45,63.49 90 top
R2  70.41,58.29 90 top
R3  7.53,61.57 180 top
R4  42.81,81.28 90 top
R5  39.45,76 90 top
R6  58.18,72.26 270 top
R7  55.75,72.26 270 top
R8  22.96,16.55 0 top
R9  36.66,16.57 0 top
R10  51.06,16.59 0 top
R11  65.16,16.61 0 top
R12  78.66,16.62 0 top
R13  78.55,44.92 90 top
R14  96.85,30.84 270 top
R15  91.11,54.9 180 top
R16  91.11,47.59 180 top
R17  91.11,40.28 180 top
R18  92.2,71.94 0 top
R19  14.52,101 180 top
R20  87.2,71.94 0 top
R21  82.2,71.94 0 top
R23  83.06,12.37 0 top
R24  69.36,12.35 0 top
R25  55.16,12.33 0 top
R26  41.06,12.3 0 top
R27  27.21,12.33 0 top
S1  65.38,60.32 90 top
S2  2.71,96.59 90 top
S3  12.71,12.61 90 top
S4  95.6,8.1 180 top
SV1  84.71,56.17 270 top
U1  55.01,47.78 180 top
U2  0.84,53.46 270 top
U3  50.47,72.87 180 top
U$1  72.8,89.09 270 top
U$2  76.6,82.07 180 top
X1  25.35,99.54 270 top

### Tracks (layer width: path | path; a pad name or v marks a point on that pad's centre or on a via)
+3V3  (via drill 0.6)
  Top 0.203: 60.63,48.54 U1.10 63.49,48.53 64.9,49.94 65.56,49.94 | R7.1 R6.1 58.35,72.94 59.4,72.94 59.9,72.44 | 30.04,80.05 IC1.2 | 30.4,76.32 C6.1 | U2.VDD 5.9,47.3 v5.9,47.44 | v6.9,54.94 9.9,54.94 10.9,55.94 10.9,57.37 C37.1 | C21.1 55.88,73.25 R7.1 | R7.1 52.38,73.11 U3.8 52.38,73.14 v43.2,73.14 | v67.9,32.94 67.8,33.04 60.2,33.04 60.21,33.05 IC3.16 | C14.1 43.34,49.03 U1.38 | S3.3 14.7,14.86 14.7,38.34 13.6,39.44 v4.4,39.44 | v34.4,57.94 35.4,56.94 40.9,56.94 41.4,56.44 41.4,52.44 42.01,51.83 C14.1 | C14.1 43.45,51.94 44.4,51.94 44.9,52.44 44.9,52.94 45.25,53.29 C10.1 47.18,50.53 U1.35 | v42.4,67.94 v33.9,67.94 | 59.9,66.94 58.9,65.94 53.9,65.94 52.59,64.63 C7.1 52.59,59.05 54.26,57.38 U1.26 | 59.9,66.94 59.9,72.44 | 59.9,66.94 60.9,65.94 60.9,60.44 60.63,60.17 C8.1 58.9,60.01 58.9,58.94 57.76,57.8 U1.19 | v64.4,68.44 67.9,68.44 68.4,67.94 v68.4,66.44 68.4,66.39 R1.2 70.55,64.44 71.9,64.44 71.9,63.44 72.3,63.04 76.5,63.04 77.9,64.44 87.4,64.44 87.9,63.94 87.9,60.44 87.4,59.94 84.71,59.94 SV1.2 | v60.9,72.94 60.4,72.94 59.9,72.44 | v69.9,23.44 68.92,24.42 C30.1 67.68,25.72 67.9,25.94 v67.9,27.94 | C31.1 88.5,30.24 88.5,28.74 89,28.24 v90,28.24 | IC4.16 90.03,14.24 v90,14.24 | 65.56,49.94 67.9,49.94 68.4,50.44 68.4,56.64 v68.6,56.84 | 65.56,49.94 C9.1 | C41.1 76.4,25.44 75.9,24.94 v75.9,23.44
  Top 0.61: C11.+ 31.93,69.47 31.9,69.44 | 31.9,69.44 30.9,68.44 21.4,68.44 v20.9,67.94 | U$2.3.3V 25.76,55.44 21.9,55.44 20.9,56.44 v20.9,57.44 19.4,57.44 17.4,59.44 v14.9,59.44 | 10.9,57.37 v10.9,59.44 | v33.9,67.94 33.4,68.44 32.9,68.44 31.9,69.44
  Top 0.813: C6.1 30.04,80.05 | C11.+ 31.93,72.91 30.4,74.44 30.4,76.32
  Bottom 0.203: v5.9,47.44 2.8,47.44 | 2.8,47.44 2.8,52.34 5.4,54.94 v6.9,54.94 | v67.9,27.94 v67.9,32.94 | v4.4,39.44 2.8,41.04 2.8,47.44 | v34.4,57.94 34.4,67.44 v33.9,67.94 | v43.2,73.14 43.2,68.74 v42.4,67.94 | v64.4,68.44 62.9,68.44 62.4,68.94 62.4,72.44 61.9,72.94 v60.9,72.94 | v90,14.24 90,23.44 | 90,23.44 v90,28.24 95,28.24 95.7,28.94 95.7,59.54 95.26,59.98 SV1.2 | v68.6,56.84 68.6,65.24 68.4,65.44 v68.4,66.44 | v69.9,23.44 v75.9,23.44 90,23.44
  Bottom 0.61: v20.9,67.94 v20.9,57.44 | v10.9,59.44 v14.9,59.44
+5V  (via drill 0.6)
  Top 0.203: 17.91,76.71 C16.1 17.9,76.58
  Top 0.61: 25.78,52.84 U$2.5V
  Top 1.016: IC2.2 17.91,76.71 | 17.9,76.58 17.9,74.44 19.67,72.67 C17.+ 19.67,69.71 17.9,67.94 v16.4,67.94 | 25.78,52.84 v18.3,52.84 18.3,31.84 v16.4,29.94 | v16.4,13.44 16.4,10.94 15.82,10.36 S3.1
  Bottom 1.016: v16.4,67.94 16.4,54.74 v18.3,52.84 | v16.4,29.94 v16.4,13.44
AS_RESET
  Top 0.203: S1.4 67.29,59.14 | 67.29,59.14 S1.3 | S1.4 66.45,63.11 C12.1 | S1.4 67.29,62.74 | 67.29,59.14 R2.2 70.41,62.6 R1.1
BAT
  Top 0.203: 6.61,72.44 C29.+
  Top 1.016: 6.61,72.44 4.4,72.44 3.71,73.13 JP1.1 2.46,85.38 1.9,85.94 1.9,89.44 2.4,89.94 5.4,89.94 6.4,90.94 6.4,93.94 6,94.34 S2.1
CH0+  (via drill 0.6)
  Top 0.203: v55.6,56.44 56.26,55.78 U1.22 56.3,53.35 56.3,51.84 56.9,51.24 v57.4,51.24 | C28.1 55.92,63.46 v55.6,63.14 | IC3.3 62.75,28.29 v61.7,27.24
  Bottom 0.203: v55.6,63.14 v55.6,56.44 | v61.7,27.24 63.9,29.44 63.9,47.44 62.9,48.44 62.9,51.24 61.9,52.24 59.9,52.24 58.9,51.24 v57.4,51.24
DATA+  (via drill 0.6)
  Top 0.203: X1.3 25.35,93.49 30.4,88.44 v30.4,86.44 | v44.9,50.44 44.9,50.14 45.5,49.54 49.39,49.54 U1.37
  Bottom 0.203: v30.4,86.44 30.4,73.94 35.4,68.94 38.9,68.94 40.1,67.74 40.1,59.74 41.4,58.44 44.5,58.44 45.3,57.64 45.3,52.34 44.9,51.94 v44.9,50.44
DATA-  (via drill 0.6)
  Top 0.203: X1.2 26.15,93.69 v31.4,88.44 | v45.9,51.44 45.9,50.34 46.2,50.04 49.39,50.04 U1.36
  Bottom 0.203: v31.4,88.44 31.9,87.94 31.9,73.94 35.9,69.94 38.9,69.94 40.9,67.94 40.9,59.94 41.9,58.94 44.9,58.94 45.9,57.94 v45.9,51.44
DIP_SW  (via drill 0.6)
  Top 0.203: 50.81,51.53 v50.9,51.44 50.9,51.53 U1.33 | v64.4,70.94 67.9,70.94 69.4,69.44 69.4,67.44 v69.9,66.94 | IC4.3 98.22,18.62 v98.9,17.94
  Bottom 0.203: v50.9,51.44 50.9,69.94 51.9,70.94 56.9,70.94 57.9,71.94 57.9,75.44 58.9,76.44 63.4,76.44 64.4,75.44 v64.4,70.94 | v69.9,66.94 69.9,62.64 70.8,61.74 U$2.D13 75.9,61.74 76.4,62.24 76.4,62.94 78.4,64.94 96.4,64.94 97.9,63.44 97.9,33.44 99.7,31.64 99.7,18.24 99.4,17.94 v98.9,17.94
GND  (via drill 0.6)
  Top 0.203: U1.9 60.63,48.04 65.9,48.04 C9.2 65.65,48.03 68.49,48.03 v68.9,48.44 | R8.1 21.99,16.66 C23.2 19.4,16.52 v19.4,13.94 | Q6.2 21.89,16.33 R8.1 | R8.1 22.11,14.23 22.9,13.44 24.9,13.44 25.9,14.44 25.9,14.98 C32.2 | C32.2 26.23,12.46 R27.1 | 35.74,16.5 C24.2 33.4,16.56 33.4,17.94 32.9,18.44 27.4,18.44 26.23,17.27 C32.2 | 35.74,16.5 R9.1 | 35.74,16.5 35.74,14.43 Q7.2 36.65,13.44 38.9,13.44 40.26,14.8 C33.2 | R26.1 40.21,15.76 C33.2 | 50.16,16.54 C25.2 47.9,16.6 47.9,17.94 47.4,18.44 41.4,18.44 40.26,17.3 C33.2 | 50.16,16.54 R10.1 | 50.16,16.54 50.16,14.54 Q8.2 50.96,13.44 52.9,13.44 54.29,14.83 C34.2 54.31,15.79 | R25.1 54.31,15.79 | 64.28,16.58 C26.2 61.9,16.64 61.9,17.94 61.4,18.44 55.9,18.44 54.31,16.85 54.31,15.79 | 64.28,16.58 R11.1 | 64.28,16.58 64.28,14.85 Q9.2 64.77,13.44 66.9,13.44 68.52,15.06 C35.2 | R24.1 C35.2 | C36.2 82.35,14.89 80.9,13.44 78.58,13.44 Q10.2 77.81,14.56 R12.1 C27.2 75.4,16.68 75.4,17.94 74.9,18.44 69.9,18.44 | R23.1 82.21,15.67 C36.2 | C35.2 68.51,17.05 69.9,18.44 | Q5.2 42.9,75.15 R5.1 39.15,75.44 37.9,75.44 36.9,76.44 36.9,90.44 38.4,91.94 41.4,91.94 | 41.4,91.94 44.4,91.94 45.68,90.66 C20.2 45.9,82.57 45.9,85.44 46.55,86.08 C19.2 54.77,86.08 C18.2 55,85.94 55.9,85.94 56.9,84.94 56.9,81.94 55.88,80.92 C21.2 62.4,79.36 | 15.73,79.94 IC2.1 15.84,80.05 | 27.77,79.94 IC1.1 28.04,80.15 | 27.9,76.54 C6.2 | 6.9,78.13 C29.- | 11.9,80.42 C15.2 | S1.1 S1.2 64.45,63.11 C12.2 v62.4,65.77 62.4,79.36 | S4.15 S4.16 97.52,5.04 | S4.15 S4.14 S4.13 S4.12 S4.11 S4.10 S4.9 88.61,7.15 v89.4,7.94 | 96,35.24 92.8,35.24 92,34.44 92,31.75 Q12.2 92.01,31.74 91,31.74 90.52,31.26 C31.2
  Top 0.203: R14.1 98.05,31.69 98.5,31.24 98.5,23.71 IC4.7 IC4.6 93.5,22.44 v93.5,23.24 | R3.1 8.4,61.55 8.4,59.94 8.77,59.57 C37.2 8.71,57.44 5.4,57.44 Q3.2 | 95.67,44.44 LED3.C 95.7,40.15 95.7,38.44 96,38.14 96,35.24 | 95.67,44.44 LED2.C LED1.C 95.7,54.89 95.7,56.84 95.1,57.44 90.9,57.44 89.9,58.44 | C13.2 57.78,32.76 58.3,32.24 66.57,32.24 IC3.6 | IC3.6 IC3.7 | C14.2 43.34,55.94 v43.4,55.94 43.4,56.44 43.9,56.94 46.7,56.94 47.2,56.44 47.2,55.31 C10.2 | v51.3,49.04 51.3,47.53 U1.41 | U$2.GND@0 27.78,50.32 28.9,51.44 C4.2 | C2.2 49.4,38.02 v49.4,35.94 | C38.2 87.51,96.14 75.1,96.14 74.8,96.44 | 85.9,85.94 86.9,85.94 87.9,84.94 C39.2 93.9,84.94 93.9,81.44 93.4,80.94 75.9,80.94 | 85.9,85.94 84.4,85.94 83.9,85.44 83.9,84.99 IC5.1 | 85.9,85.94 C40.2 C42.2 | U$1.10 74.8,96.44 | 74.8,96.44 74.8,82.04 75.9,80.94 | 75.9,80.94 72.9,80.94 72.4,80.44 72.4,79.44 | LED7.C 81.9,66.79 | 81.9,66.79 81.55,66.79 80.9,67.44 80.9,69.44 80.4,69.94 77.9,69.94 77.4,70.44 | 77.4,70.44 77.4,75.44 76.9,75.94 72.9,75.94 72.4,76.44 72.4,79.44 | BAT1.2 41.4,96.3 41.4,91.94 | C8.2 57.1,60.21 57.1,61.64 57.4,61.94 58.9,61.94 59.14,62.18 C28.2 59.14,64.68 v59.9,65.44 | C7.2 55.95,60.12 | 55.95,60.12 57.01,60.12 C8.2 | C7.2 | 62.4,79.36 72.32,79.36 72.4,79.44 | SV1.3 88.9,57.44 89.9,58.44 | 89.9,58.44 89.9,63.94 88.4,65.44 81.9,65.44 81.9,66.79 | U$2.GND@2 75.75,64.29 76.4,64.94 76.4,69.94 76.9,70.44 77.4,70.44 | IC3.6 66.57,26.11 66.4,25.94 65.9,25.94 65.7,25.74 65.7,24.44 C30.2 65.68,22.16 65.9,21.94 69.4,21.94 69.9,21.44 69.9,18.44 | C22.2 11.91,4.43 v10.4,5.94 | S4.15 96.23,7.24 v96,7.24 | v83.9,18.94 82.9,18.94
  Top 0.203: 82.9,18.94 82.3,18.34 82.3,15.86 C36.2 | 96.9,31.74 R14.1 | 95.67,44.44 87.9,44.44 87.4,44.94 87.4,45.94 86.9,46.44 82.9,46.44 82.4,45.94 82.4,45.15 Q11.2 78.64,43.98 R13.1 78.55,43.94 70.9,43.94 v69.4,45.44 | U1.23 55.76,54.48 54.7,55.54 54.7,57.64 54.59,57.75 C7.2 | 96,35.24 96.85,34.39 R14.1 | C41.2 80.9,22.44 82.9,20.44 82.9,18.94 | U1.20 57.26,58.58 56.9,58.94 56.9,60.01 C8.2 | U1.21 56.76,57.68 55.84,58.6 55.84,60.01 55.95,60.12
  Top 0.406: v2.8,101.84 6.3,101.84 7.1,101.04 8.42,101.04 LED5.C | X1.5 23.75,92.79 v23.4,92.44 | BAT1.2 41.32,98.31 39.9,99.74 33.9,99.74 32.4,98.24 v32.4,93.94
  Top 0.813: C5.2 25.73,80.61 26.4,79.94 27.77,79.94 | C6.2 28.04,80.15 | 27.9,76.54 27.9,74.44 26.53,73.07 C11.- 23.9,71.03 v23.9,74.44 | 6.9,78.13 6.9,86.44 5.4,87.94 3.73,87.94 JP1.2 | C29.- 10.88,77.92 | 10.88,77.92 11.9,78.94 11.9,80.42 | C17.- 12.31,71.03 v10.9,72.44 10.9,72.94 10.88,72.96 10.88,77.92 | R3.1 8.38,63.92 9.4,64.94 v11,64.94
  Top 1.016: C15.2 13.73,80.61 14.4,79.94 15.73,79.94 | C16.2 15.84,80.05
  Bottom 0.203: U$2.GND@1 U$2.GND@0 | v49.4,35.94 51.3,35.94 v51.3,49.04 43.4,49.04 v43.4,55.94 43.4,56.44 42.9,56.94 33.9,56.94 | 33.9,56.94 32.9,57.94 32.9,65.44 32.4,65.94 24.9,65.94 23.9,66.94 v23.9,74.44 | v62.4,65.77 62.07,65.44 v59.9,65.44 | v34.4,54.44 34.4,56.44 33.9,56.94 | v10.4,5.94 10.4,10.94 11.4,11.94 18.4,11.94 19.4,12.94 v19.4,13.94 | v96,7.24 96,23.24 v93.5,23.24 | v89.4,7.94 89.4,9.44 88.4,10.44 88.4,17.44 86.9,18.94 v83.9,18.94 | v68.9,48.44 69.4,47.94 v69.4,45.44
  Bottom 0.406: 1.7,96.94 1.7,88.44 2.22,87.92 JP1.2 | 1.7,96.94 1.7,100.74 v2.8,101.84 | 1.7,96.94 20.4,96.94 20.9,96.44 20.9,93.94 22.4,92.44 v23.4,92.44 31.4,92.44 32.4,93.44 v32.4,93.94
  Bottom 0.61: JP4.2 57.94,98.9 56.4,100.44 42.4,100.44 41.4,99.44 41.4,96.38 BAT1.2
  Bottom 0.813: v23.9,74.44 11.4,74.44 10.9,73.94 v10.9,72.44 11,72.34 v11,64.94
  other vias: 34.4,41.44 46.1,37.74 48.4,82.44 55,82.44
  pour Top (isolate 0.254): 50.1,48.64 50.1,47.94 39.9,47.94 39.9,41.44 38.2,39.74 31.9,39.74 31.9,55.94 38.4,55.94 39.9,54.44 39.9,48.64
  pour Bottom (isolate 0.305): 50.1,48.54 50.1,47.94 39.9,47.94 39.9,41.44 38.2,39.74 31.9,39.74 31.9,55.94 38.4,55.94 39.9,54.44 39.9,48.64 50.1,48.64
  pour Top (isolate 0.2): 50.2,44.64 50.2,43.84 47.9,43.84 47.9,42.74 49.6,42.74 49.6,37.04 42.7,37.04 42.7,44.64
  pour Bottom: 50.2,44.64 50.2,43.84 47.9,43.84 47.9,42.74 49.6,42.74 49.6,37.04 42.7,37.04 42.7,44.64
  pour Bottom: 50.5,73.94 53.1,73.94 53.1,81.44 55.9,81.44 55.9,87.44 47.6,87.44 47.6,81.44 50.5,81.44
  pour Top (isolate 0.305): 50.5,73.94 53.1,73.94 53.1,81.44 55.9,81.44 55.9,87.44 47.6,87.44 47.6,81.44 50.5,81.44
  pour Bottom (isolate 0.305): 0,-0.06 0,104.64 101,104.64 101,-0.06
  pour Top (isolate 0.305): 0,-0.06 0,104.64 101,104.64 101,-0.06
GSM_RX  (via drill 0.6)
  Top 0.203: U1.5 59.29,46.03 v58.9,45.64 | v62.8,34.24 66.2,34.24 v66.4,34.44
  Bottom 0.203: v58.9,45.64 59.3,46.04 61.6,46.04 62,45.64 62,41.24 62.8,40.44 v62.8,34.24 | v66.4,34.44 71.2,34.44 72.1,33.54 72.1,32.74 72.4,32.44 73.96,32.44 U$2.D2
GSM_TX  (via drill 0.6)
  Top 0.203: U1.6 59.31,46.53 v58.9,46.94 | v62.9,41.84 62.9,41.44 v64.9,39.44
  Bottom 0.203: v58.9,46.94 59.3,46.54 62,46.54 62.9,45.64 v62.9,41.84 | v64.9,39.44 66.1,38.24 71.6,38.24 72.4,37.44 72.4,35.84 73.16,35.08 U$2.D3
LED1  (via drill 0.6)
  Top 0.203: 90.3,54.86 R15.2 90.2,54.84 88.4,54.84 87.9,54.34 87.9,48.44 87.4,47.94 82.9,47.94 81.79,49.05 81.79,50.95 81.1,51.64 74.11,51.64 U$2.D9 | U1.14 62.49,50.53 62.9,50.94 62.9,52.44 v63.3,52.84
  Bottom 0.203: v63.3,52.84 70.5,52.84 71.7,51.64 74.01,51.64 U$2.D9
LED2  (via drill 0.6)
  Top 0.203: 90.2,47.53 R16.2 90.21,47.54 89,47.54 88.6,47.14 82.5,47.14 80.59,49.05 U$2.D8 | U1.13 62.99,50.03 63.4,50.44 63.4,51.44 63.9,51.94 v64.4,51.94
  Bottom 0.203: v64.4,51.94 69.9,51.94 72.9,48.94 73.95,48.94 U$2.D8
LED3  (via drill 0.6)
  Top 0.203: 90.14,40.16 R17.2 90.3,40.32 90.3,42.34 89.7,42.94 v88.9,42.94 | U1.12 63.19,49.53 v64.2,50.54
  Bottom 0.203: v64.2,50.54 69.6,50.54 70.8,49.34 70.8,46.34 71.9,45.24 U$2.D7 76.6,45.24 76.9,44.94 76.9,43.94 77.9,42.94 v88.9,42.94 88.66,42.7
MCLR
  Top 0.203: U1.7 60.63,47.04 69.4,47.04 70.41,48.05 R2.1 70.51,57.34 72.1,57.34 72.7,57.94 76.8,57.94 77.4,58.54 77.4,61.94 77.98,62.52 SV1.1
MUX1_EN
  Top 0.203: Q11.1 78.68,45.9 R13.2 78.4,45.92 78.4,46.44 77.9,46.94 72.9,46.94 72.4,46.44 63.9,46.44 62.99,45.53 U1.4
MUX2_EN  (via drill 0.6)
  Top 0.203: R14.2 94.75,29.99 94,30.74 94,31.67 Q12.1 93.9,31.77 v93.9,33.44 | U1.11 59.81,49.03 58.9,49.94 58.9,51.74 v60.4,53.24
  Bottom 0.203: v60.4,53.24 60.9,53.74 71.9,53.74 72.3,54.14 U$2.D10 80.3,54.14 81.9,52.54 81.9,48.94 82.9,47.94 92.4,47.94 93.9,46.44 v93.9,33.44
MUX_A  (via drill 0.6)
  Top 0.203: IC3.11 66.57,39.77 v65.9,40.44 | v65.9,44.44 64.2,44.44 63.8,44.04 60.63,44.04 U1.1 | IC4.11 84.91,22.44 84.4,22.94 84.4,36.84 83.6,37.64 74.08,37.64 U$2.D4
  Bottom 0.203: v65.9,44.44 v65.9,40.44 66,40.44 67.5,38.94 72.74,38.94 U$2.D4
MUX_B  (via drill 0.6)
  Top 0.203: IC3.10 67.84,39.8 v67.2,40.44 | v67.2,44.44 66.4,45.24 64.2,45.24 63.49,44.53 U1.2 | IC4.10 86.64,23.71 85.4,24.94 85.4,39.34 84.6,40.14 74.08,40.14 U$2.D5
  Bottom 0.203: v67.2,44.44 v67.2,40.44 68.2,39.44 73.34,39.44 U$2.D5
MUX_C  (via drill 0.6)
  Top 0.203: IC3.9 69.11,39.84 v68.5,40.44 | v68.5,44.44 67.1,45.84 64.2,45.84 63.39,45.03 U1.3 | IC4.9 87.37,24.98 86.4,25.94 86.4,40.44 v85.4,41.44
  Bottom 0.203: v68.5,40.44 v68.5,44.44 70.1,44.44 71.8,42.74 74.02,42.74 U$2.D6 76.74,42.7 77.3,42.14 84.7,42.14 v85.4,41.44
N$1
  Top 0.203: U1.40 37.23,48.03 | 37.23,48.03 Q2.2 | C3.1 34.89,48.03 37.23,48.03
N$2
  Top 0.203: U1.39 37.23,48.53 | 37.23,48.53 Q2.1 | C4.1 34.53,48.53 37.23,48.53
N$3
  Top 0.203: U1.48 47.64,44.03 Q1.4 47.64,39.77 C2.1
N$4
  Top 0.203: U1.47 44.6,44.53 Q1.1 44.6,39.77 C1.1
N$5
  Top 0.203: 16.77,82.61 IC2.3 | 15.9,86.58 JP2.1
  Top 1.016: C15.1 16.77,82.61 | IC2.3 16.96,83.38 15.9,84.44 15.9,86.58
N$6
  Top 0.203: LED1.A 91.96,54.86 R15.1
N$7
  Top 0.203: BAT1.1 42.81,83.73 R4.2
N$8
  Top 0.203: C18.1 53.29,84.38 Q4.1 52.38,82.72 U3.1
N$9
  Top 0.203: U1.56 54.76,36.58 54.9,36.44 55.73,36.44 C13.1
N$10
  Top 0.203: U2.GND U2.GND@1 2.77,42.07 3.4,41.44 14.4,41.44 15.9,42.94 15.9,43.56 U2.GND@2 | U2.VSS 3.27,49.3 U2.GND | Q3.3 5.17,54.7 2.8,52.34 2.8,49.83 U2.GND
N$11  (via drill 0.6)
  Top 0.203: C39.1 88.9,82.94
  Top 0.813: 88.9,82.94 87.9,83.94 IC5.3 | C39.1 v92.4,82.94
  Bottom 0.813: v92.4,82.94 92.4,81.44 91.9,80.94 72.9,80.94 72.4,81.44 72.4,90.44 70.9,91.94 JP3.1
N$12
  Top 0.203: C19.1 50.25,84.33 Q4.4 51.1,82.72 U3.2
N$13
  Top 0.203: U3.3 49.84,79.5 49.2,80.14 45.89,80.14 C20.1 45.6,80.43 R4.1
N$14
  Top 0.203: U3.4 48.56,76.77 47.9,77.44 45.9,77.44 45.4,76.94 45.4,76.15 Q5.3
N$15
  Top 0.203: Q6.3 22.81,10.85 21.9,9.94 21.9,4.27 J1.SLEEVE
N$16
  Top 0.203: IC4.8 92.96,24.98 Q12.3
N$18
  Top 0.203: Q7.3 36.62,10.86 35.8,10.04 35.8,4.34 J2.SLEEVE
N$19
  Top 0.203: C32.1 28.53,15.31 | C33.1 42.53,15.81 | 27.9,6.44 27.9,8.27 J1.TIP | 39.6,2.14 39.4,1.94 | J5.TIP 83.64,8.68 | S3.2 13.84,12.74 11,12.74 10.6,12.34 10.6,7.44 11.61,6.43 C22.1
  Top 0.305: 28.53,15.31 29.9,13.94 29.9,10.44 29.79,10.44 J1.TIP | 42.53,15.81 44.4,13.94 44.4,11.08 J2.TIP | J3.TIP 55.7,8.74 57.9,10.94 57.9,14.2 C34.1 | J4.TIP 71.7,10.44 71.7,14.63 C35.1 | 83.64,8.68 85.9,10.94 85.9,14.26 C36.1
  Top 0.61: J2.TIP 41.73,6.77 39.4,4.44 39.4,1.94 38.9,1.44 34.4,1.44 33.9,1.94 33.9,4.94 33.4,5.44 28.9,5.44 27.9,6.44 | J3.TIP 55.7,6.74 53.4,4.44 53.4,2.44 | 53.4,2.44 53.4,1.94 52.9,1.44 47.8,1.44 47.1,2.14 39.6,2.14 | J4.TIP 69.67,6.21 67.4,3.94 67.4,2.44 | 67.4,2.44 66.4,1.44 61.9,1.44 61.3,2.04 53.8,2.04 53.4,2.44 | J5.TIP 83.64,6.18 81.4,3.94 81.4,2.44 80.4,1.44 75.4,1.44 74.9,1.94 67.9,1.94 67.4,2.44 | J1.TIP 27.76,6.3 25.4,3.94 25.4,1.94 24.9,1.44 20.9,1.44 20.4,1.94 20.4,5.94 19.9,6.44 C22.1
N$20  (via drill 0.6)
  Top 0.203: Q11.3 82.4,43.9 82.4,42.94 80.9,41.44 71.9,41.44 71.4,40.94 71.4,28.44 v71.9,27.94 | v69.4,26.44 69.11,26.74 IC3.8
  Bottom 0.203: v71.9,27.94 70.4,26.44 v69.4,26.44
N$21
  Top 0.203: Q8.3 50.93,10.47 49.8,9.34 49.8,9.24 49.7,9.14 49.7,4.41 J3.SLEEVE
N$22  (via drill 0.6)
  Top 0.203: S4.1 v97.5,9.24 | v98.7,19.94 98.7,19.89 IC4.4
  Bottom 0.203: v97.5,9.24 97.5,19.94 v98.7,19.94
N$23
  Top 0.203: Q9.3 64.74,10.28 63.7,9.24 63.7,4.38 J4.SLEEVE
N$24
  Top 0.203: S4.2 96.23,14.24 98,14.24 98,17.36 IC4.2
N$25
  Top 0.203: Q10.3 78.55,10.09 77.6,9.14 77.6,4.45 J5.SLEEVE
N$26  (via drill 0.6)
  Top 0.203: S4.3 94.96,9.7 v94.5,9.24 | v93.5,21.14 96.15,21.14 IC4.5
  Bottom 0.203: v94.5,9.24 94,9.24 93.5,9.74 v93.5,21.14
N$27
  Top 0.203: IC4.1 93.69,16.09 S4.4
N$28
  Top 0.203: IC4.12 92.42,21.17 S4.5
N$29
  Top 0.203: IC4.15 91.8,17.36 91.8,12.64 91.15,12.64 S4.6
N$30
  Top 0.203: IC4.14 88.2,18.62 88.2,12.64 89.88,12.64 S4.7
N$31
  Top 0.203: IC4.13 87.5,19.89 87.5,11.24 88.61,11.24 S4.8
N$32
  Top 0.203: LED2.A 91.96,47.52 R16.1
N$33
  Top 0.203: LED3.A 91.96,40.18 R17.1
N$34
  Top 0.61: R19.2 LED5.A
N$35  (via drill 0.6)
  Top 0.203: 89.4,96.03 C38.1 89.58,96.04 | LED6.A LED4.A 93.05,66.74 v95.4,66.74
  Top 0.813: IC5.2 82.35,82.99 81.9,83.44 81.9,87.44 82.4,87.94 C40.1 C42.1 83.9,92.94 84.4,93.44 88.9,93.44 89.4,93.94 89.4,96.03 | 89.58,96.04 92.8,96.04 U$1.1
  Bottom 0.203: v95.4,66.74 96.4,67.74 96.4,99.24 95.5,100.14 92.85,100.14 U$1.1
N$37
  Top 0.203: LED4.C 93.05,68.34 R18.2
N$38
  Top 0.203: LED6.C 88.05,68.34 R20.2
N$39
  Top 0.203: LED7.A 83.05,68.34 R21.2
N$40
  Top 0.203: R21.1 79.7,71.94 78.8,72.84 U$1.13
P1_CON  (via drill 0.6)
  Top 0.203: R27.2 28.06,11.11 27.4,10.44 25.9,10.44 25.26,9.8 J1.TSH | v25.3,19.24 26,19.94 28.9,19.94 30.9,21.94 30.9,26.94 31.4,27.44 48.4,27.44 51.5,30.54 51.5,31.54 53.76,33.8 U1.54
  Bottom 0.203: J1.TSH 25.26,19.2 v25.3,19.24
P1_ON
  Top 0.203: Q6.1 R8.2 23.9,16.64 23.9,20.44 24.9,21.44 28.9,21.44 29.9,22.44 29.9,27.44 31.4,28.94 45.4,28.94 45.9,28.44 48.4,28.44 50.9,30.94 50.9,31.94 53.26,34.3 U1.53
P2_CON  (via drill 0.6)
  Top 0.203: R26.2 41.9,10.94 41.4,10.44 39.9,10.44 39.23,9.77 J2.TSH | U1.58 55.76,40.2 v55.6,40.04 | v39.2,19.24 39.2,24.74 39.9,25.44 48.5,25.44 52.7,29.64 52.7,31.04 55.1,33.44 v55.1,34.74
  Bottom 0.203: v55.6,40.04 55.4,40.04 55.3,39.94 55.3,34.94 v55.1,34.74 | J2.TSH 39.23,19.24 v39.2,19.24
P2_ON
  Top 0.203: Q7.1 37.51,14.5 R9.2 37.6,16.66 37.6,25.74 38.3,26.44 48.5,26.44 52.1,30.04 52.1,31.34 54.26,33.5 U1.55
P3_CON  (via drill 0.6)
  Top 0.203: R25.2 55.9,12.21 55.9,10.94 55.4,10.44 53.9,10.44 53.2,9.74 J3.TSH | v53.2,19.04 53.2,27.74 53.9,28.44 53.9,29.94 v56.4,32.44 | v57.3,39.84 57.3,40.24 56.76,40.78 U1.60
  Bottom 0.203: v57.3,39.84 57.3,33.44 v56.4,32.44 | J3.TSH v53.2,19.04
P3_ON  (via drill 0.6)
  Top 0.203: Q8.1 51.91,14.41 R10.2 51.91,27.85 53.2,29.14 53.2,30.74 v56.2,33.74 | U1.59 56.26,40.58 56.4,40.44 56.4,39.14 v56.2,38.94
  Bottom 0.203: v56.2,38.94 v56.2,33.74
P4_CON  (via drill 0.6)
  Top 0.203: R24.2 70.4,12.16 70.4,10.94 69.9,10.44 67.9,10.44 67.17,9.71 J4.TSH | U1.62 57.76,41.18 58.9,40.04 v59.5,40.04 | v67.1,19.04 65.7,20.44 55.9,20.44 55.4,20.94 55.4,28.44 56.4,29.44 v58.4,29.44
  Bottom 0.203: J4.TSH 67.17,19.04 v67.1,19.04 | v58.4,29.44 59.5,30.54 v59.5,40.04
P4_ON  (via drill 0.6)
  Top 0.203: Q9.1 66.01,14.65 R11.2 66.01,19.33 65.4,19.94 55.4,19.94 54.4,20.94 54.4,28.94 56.4,30.94 v58.4,30.94 | U1.61 57.26,41.08 58.4,39.94 v58.4,38.94
  Bottom 0.203: v58.4,30.94 v58.4,38.94
P5_CON  (via drill 0.6)
  Top 0.203: J5.TSH 81.14,9.68 81.9,10.44 83.4,10.44 83.9,10.94 83.9,12.36 R23.2 | U1.63 58.26,43.44 69.4,43.44 70.9,41.94 70.9,25.44 75.9,20.44 v80.4,20.44
  Bottom 0.203: v80.4,20.44 81.14,19.7 J5.TSH
P5_ON
  Top 0.203: Q10.1 79.55,16.58 R12.2 79.51,19.33 79.4,19.44 75.9,19.44 70.4,24.94 70.4,41.44 68.9,42.94 58.76,42.94 U1.64
PORT1  (via drill 0.6)
  Top 0.203: J1.RING 17.54,8.63 C23.1 17.54,18.58 22.4,23.44 22.4,38.54 24,40.14 25.78,40.14 U$2.A0 26.68,40.16 27.9,38.94 39.4,38.94 | 39.4,38.94 41.9,41.44 41.9,45.03 U1.46 | IC3.5 65.3,27.84 63.9,26.44 63.9,24.94 v63.4,24.44 | v40.9,37.94 40.9,38.44 40.4,38.94 39.4,38.94
  Bottom 0.203: v63.4,24.44 61.9,24.44 58.4,27.94 48.9,27.94 47.9,28.94 47.9,34.44 47.4,34.94 43.9,34.94 v40.9,37.94
PORT2  (via drill 0.6)
  Top 0.203: U$2.A1 25.82,37.64 v31.7,37.64 39.8,37.64 43.5,33.94 49.9,33.94 51.26,35.3 U1.49 51.26,43.4 51.8,43.94 v52.9,43.94 | J2.RING 31.34,8.8 C24.1 | IC3.15 61.48,40.35 v61.4,40.44
  Bottom 0.203: 25.82,37.64 U$2.A1 | J2.RING 31.7,8.41 v31.7,37.64 | v61.4,40.44 57.9,43.94 v52.9,43.94
PORT3  (via drill 0.6)
  Top 0.203: U1.50 51.76,35.1 49.6,32.94 v45.9,32.94 42.9,32.94 40.76,35.08 32.96,35.08 v32.9,35.14 25.86,35.14 U$2.A2 | C25.1 45.84,8.55 J3.RING | IC3.4 64.03,28.07 62.4,26.44 v62.4,23.04
  Bottom 0.203: J3.RING 45.7,21.94 44.2,23.44 33.9,23.44 32.9,24.44 v32.9,35.14 | v62.4,23.04 60.4,24.94 58.4,26.94 46.9,26.94 45.9,27.94 v45.9,32.94
PORT4  (via drill 0.6)
  Top 0.203: U$2.A3 v34.2,32.54 41.8,32.54 42.4,31.94 49.4,31.94 52.26,34.8 U1.51 | C26.1 59.84,8.58 J4.RING | IC3.2 61.48,28.53 60.9,27.94 60.4,27.94 59.7,27.24 v59.7,21.94
  Bottom 0.203: J4.RING 59.67,21.94 | 59.67,21.94 v59.7,21.94 | 59.67,21.94 57.47,24.24 34.9,24.24 34.2,24.94 v34.2,32.54
PORT5  (via drill 0.6)
  Top 0.203: C27.1 73.34,8.71 J5.RING | v58.4,24.94 58.4,27.44 59.4,28.44 59.9,28.44 60.21,28.75 IC3.1 | U1.52 52.76,34.6 50.3,32.14 50.3,31.54 48.2,29.44 46.4,29.44 45.84,30 35.6,30 | 35.6,30 v35.6,30.04 | 35.6,30 U$2.A4
  Bottom 0.203: J5.RING 73.64,19.94 73.6,19.94 71.6,21.94 61.4,21.94 v58.4,24.94 36.4,24.94 35.6,25.74 v35.6,30.04
RB6  (via drill 0.6)
  Top 0.203: v59.9,54.44 59.3,55.04 58.8,55.04 58.76,55 U1.17 | U$2.D11 80.67,56.67 81.4,55.94 81.4,53.04 82.1,52.34 84.69,52.34 SV1.5
  Bottom 0.203: v59.9,54.44 60,54.34 71.3,54.34 71.9,54.94 71.9,56.34 72.2,56.64 74.03,56.64 U$2.D11
RB7  (via drill 0.6)
  Top 0.203: v58.9,56.44 58.26,55.8 U1.18
  Bottom 0.203: v58.9,56.44 60,55.34 70.3,55.34 70.9,55.94 70.9,58.64 71.4,59.14 73.99,59.14 U$2.D12 74.09,59.24 81.5,59.24 81.9,58.84 81.9,55.44 82.44,54.9 SV1.4
RTC_ON  (via drill 0.6)
  Top 0.203: R5.2 42.92,76.85 Q5.1 39.89,76.94 38.9,77.94 v38.9,79.94 | v34.4,79.44 34.4,74.44 36.9,71.94 45.9,71.94 46.9,70.94 v46.9,68.94 | U1.27 53.76,57.08 52.4,58.44 51.9,58.44 51.4,58.94 51.4,66.44 46.9,66.44 v46.9,65.94
  Bottom 0.203: v38.9,79.94 34.9,79.94 v34.4,79.44 | v46.9,65.94 v46.9,68.94
RX2  (via drill 0.6)
  Top 0.203: U$1.2 90.8,101.34 91.4,101.94 95.4,101.94 96.1,101.24 96.1,76.14 95.4,75.44 87,75.44 86.4,74.84 86.4,71.99 R20.1 86.35,74.99 85.9,75.44 84.4,75.44 v83.9,74.94 | U1.15 60.63,51.04 62,51.04 62.4,51.44 62.4,55.44 62.9,55.94 64.9,55.94 65.4,56.44 v65.4,57.44
  Bottom 0.203: v83.9,74.94 68.4,74.94 67.4,73.94 67.4,59.44 v65.4,57.44 | JP4.3 63.48,94.94 88.9,94.94 90.8,96.84 U$1.2
SCK1  (via drill 0.6)
  Top 0.203: U1.31 51.76,55.38 49.3,57.84 49.3,60.54 48.9,60.94 39.9,60.94 38.9,59.94 30.4,59.94 28.4,57.94 28.4,52.48 27.5,51.58 22.04,51.58 v20.9,50.44 | v5.9,49.44 5.9,48.74 5.5,48.34 4.01,48.34 U2.CLK
  Bottom 0.203: v20.9,50.44 6.9,50.44 v5.9,49.44
SCL1  (via drill 0.6)
  Top 0.203: U3.6 49.84,69 50.4,68.44 55.2,68.44 55.7,68.94 | 55.7,68.94 55.7,71.36 R7.2 | U1.44 46.79,46.03 v46.6,46.04 | v29.1,60.44 30.6,61.94 41.4,61.94 46.4,66.94 v55.4,66.94 | v56.4,68.94 55.7,68.94
  Bottom 0.203: v46.6,46.04 42.2,46.04 42.2,41.44 39.5,38.74 30.2,38.74 29.1,39.84 v29.1,60.44 | v55.4,66.94 56.4,67.94 v56.4,68.94
SD_ON  (via drill 0.6)
  Top 0.203: Q3.1 6.17,59.71 6.4,59.94 6.4,61.29 R3.2 6.9,61.79 6.9,64.94 8.4,66.44 v43.4,66.44 | U1.28 53.26,56.88 52.4,57.74 51.8,57.74 50.9,58.64 50.9,63.44 49.9,64.44 v45.4,64.44
  Bottom 0.203: v45.4,64.44 v43.4,66.44
SDA1  (via drill 0.6)
  Top 0.203: U3.5 48.56,68.27 48.9,67.94 | 48.9,67.94 57.9,67.94 58.4,68.44 58.4,71.19 R6.2 | v30.1,62.94 41.4,62.94 46.4,67.94 48.9,67.94 | v45.4,47.04 47.3,47.04 47.8,46.54 49.39,46.54 U1.43
  Bottom 0.203: v45.4,47.04 41.6,47.04 41.6,41.64 39.2,39.24 30.8,39.24 30.1,39.94 v30.1,62.94
SDI1  (via drill 0.6)
  Top 0.203: U1.29 52.76,56.58 52.3,57.04 51.6,57.04 50.3,58.34 50.3,62.54 49.9,62.94 v44.4,62.94 | v42.1,65.24 41.9,65.44 13.4,65.44 12.4,64.44 12.4,54.94 11.4,53.94 5.9,53.94 5.4,53.44 5.4,50.64 5,50.24 4.02,50.24 U2.MISO/DAT0
  Bottom 0.203: v44.4,62.94 v42.1,65.24
SDO1  (via drill 0.6)
  Top 0.203: U1.30 52.26,56.08 51.9,56.44 51.4,56.44 49.8,58.04 49.8,62.04 49.5,62.34 45.7,62.34 44.8,61.44 39,61.44 v38.6,61.04 | v38.4,64.44 13.9,64.44 13.2,63.74 13.2,43.24 12.9,42.94 6.9,42.94 6.4,43.44 6.4,45.74 5.8,46.34 4.01,46.34 U2.MOSI/CMD
  Bottom 0.203: v38.6,61.04 38.6,64.24 v38.4,64.44
SS1  (via drill 0.6)
  Top 0.203: U1.32 51.26,55.08 48.7,57.64 48.7,60.04 48.4,60.34 40.2,60.34 39.3,59.44 32.5,59.44 30.9,57.84 v30.9,52.94 | v30.9,50.44 30.9,42.94 v20.9,42.94 | v5.4,42.94 5.4,44.94 5.1,45.24 4.02,45.24 U2.!CS!/NC/DAT3
  Bottom 0.203: v30.9,52.94 v30.9,50.44 | v20.9,42.94 v5.4,42.94
TX2  (via drill 0.6)
  Top 0.2: R18.1 91.35,73.39
  Top 0.203: 91.35,73.39 91.9,73.94 96.4,73.94 97.4,74.94 97.4,101.44 95.9,102.94 89.9,102.94 88.8,101.84 U$1.3 | v89.4,74.44 90.4,74.44 91.35,73.49 R18.1 | v61.4,58.44 61.4,51.53 U1.16
  Bottom 0.203: v89.4,74.44 87.9,75.94 67.4,75.94 65.9,74.44 65.9,60.94 63.4,58.44 v61.4,58.44 | JP4.4 64.82,96.14 87.4,96.14 88.8,97.54 U$1.3
VBUS  (via drill 0.6)
  Top 0.203: v29.4,93.94 29.4,91.94 32.9,88.44 32.9,74.44 36.4,70.94 v44.9,70.94 | v48.9,53.44 48.9,52.84 47.9,51.84 47.9,51.03 U1.34
  Top 0.406: v29.4,93.94 27.5,93.94 26.95,94.49 X1.1
  Top 0.61: S2.3 14.8,98.84 15.4,99.44 | 15.4,99.44 15.4,100.97 R19.1 | 15.4,99.44 17.4,99.44 v17.9,98.94
  Bottom 0.203: v44.9,70.94 48.4,70.94 49.4,69.94 49.4,53.94 v48.9,53.44
  Bottom 0.61: v17.9,98.94 28.9,98.94 29.9,97.94 29.9,94.44 v29.4,93.94
VIN
  Top 0.203: 28.73,82.61 IC1.3 | 18.62,86.44 JP2.2
  Top 0.813: C5.1 28.73,82.61 | 18.4,86.66 JP2.2
  Top 1.016: C5.1 23.85,85.49 22.9,86.44 18.62,86.44 | S2.2 16.5,95.84 18.4,93.94 18.4,86.66
  Bottom 0.203: 18.62,86.44 JP2.2
  Bottom 0.61: 18.62,86.44 22.4,86.44 22.9,86.94 22.9,89.44 23.9,90.44 32.9,90.44 34.4,91.94 55.4,91.94 | JP4.1 55.4,91.94 | 55.4,91.94 JP3.2
  Bottom 0.813: U$2.VIN 23.2,45.24 22.9,44.94 22.9,41.44 19.4,37.94 1.9,37.94 1.4,38.44 1.4,79.44 2.9,80.94 6.4,80.94 9.4,83.94 9.4,88.94 10.9,90.44 16.9,90.44 18.4,88.94 18.4,86.66 JP2.2

### Text on the board
210bmp: WADTL-V1